# Altium project int_lock.PrjPcb (part 1 of 2)
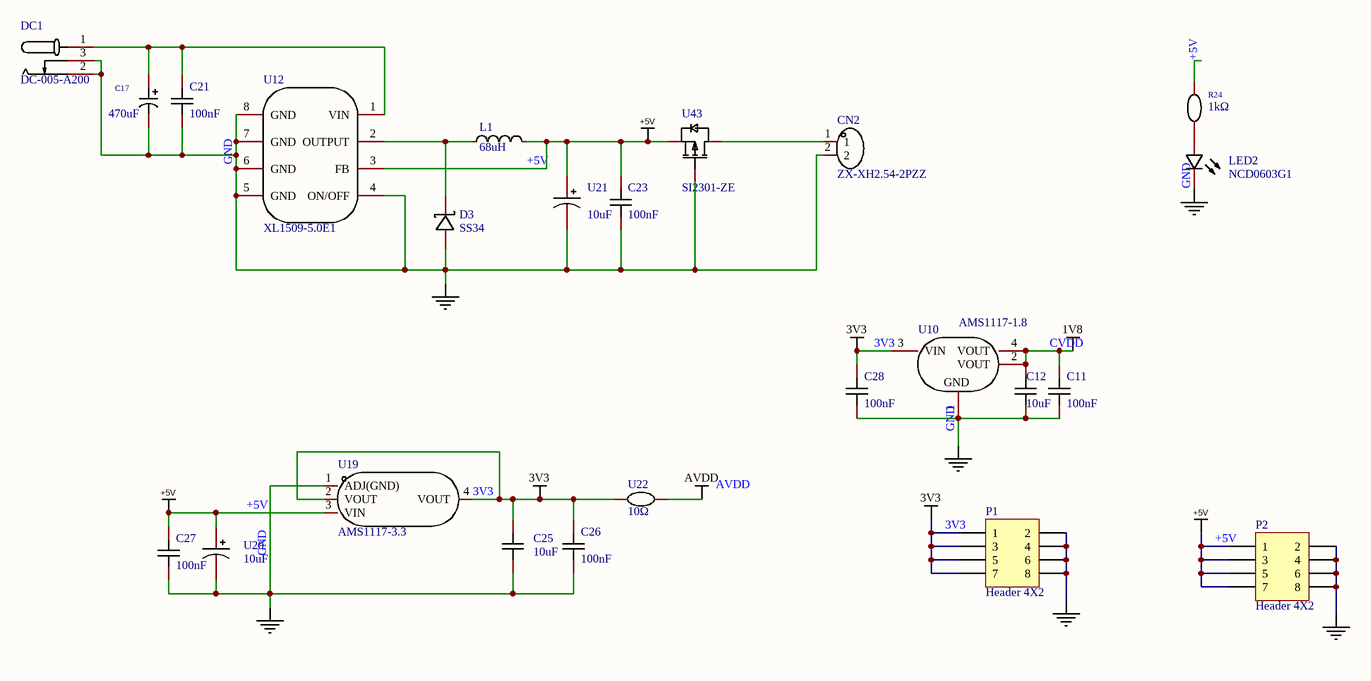
[diagram p0: 4_POW.schdoc.schdoc]
4 sheets, 119 parts. Net scope: global (net labels, ports and power ports of the same name join across sheets).
Board file: PCB1.pcbdoc
Sheets:
  4_POW.schdoc.schdoc
  3_语音模块.schdoc.schdoc
  1_Board.schdoc.schdoc
  2_MCU.schdoc.schdoc

## Sheet 4_POW.schdoc.schdoc
size 309 x 223 mm; Symbol: Sheet-Symbol_A4; Device: Sheet-Symbol_A4; @Page Name: POW.Schematic1; @Create Date: 2023-10-28; @Page Count: 4; @Page No: 3; @Project Name: New Project_2023-10-25_23-03-02; @Schematic Name: Schematic1; @Update Date: 2023-11-27; Company: 嘉立创EDA; Page Size: A4; Version: V1.0; SheetNumber: 1; SheetTotal: 4

### Parts
C11  100nF  [C0603]
C12  10uF  [C0603]
C17  470uF  [CAP-SMD_BD6.3-L6.6-W6.6-LS7.6-RD]
C21  100nF  [C0603]
C23  100nF  [C0603]
C25  10uF  [C0603]
C26  100nF  [C0603]
C27  100nF  [C0603]
C28  100nF  [C0603]
CN2  ZX-XH2.54-2PZZ  [CONN-TH_2P-P2.50_HX25003-2A]
D3  SS34  [SMA_L4.3-W2.6-LS5.0-RD]
DC1  DC-005-A200  [DC-IN-TH_DC-005-A200]
L1  68uH  [IND-SMD_L6.0-W6.0_SWPA6045S]
LED2  NCD0603G1  [LED0603-RD]
P1  Header 4X2  [HDR2X4]
P2  Header 4X2  [HDR2X4]
R24  1kΩ  [R0603]
U10  AMS1117-1.8  [SOT-223-4_L6.5-W3.5-P2.30-LS7.0-BR]
U12  XL1509-5.0E1  [SOIC-8_L5.0-W4.0-P1.27-LS6.0-BL]
U19  AMS1117-3.3  [SOT-223-3_L6.5-W3.4-P2.30-LS7.0-BR]
U20  10uF  [CAP-TH_BD6.3-P2.50-D0.5-FD]
U21  10uF  [CAP-TH_BD6.3-P2.50-D0.5-FD]
U22  10Ω  [R0603]
U43  SI2301-ZE  [SOT-23-3_L2.9-W1.3-P1.90-LS2.4-BR]

### Nets
3V3: C25.2 C26.2 C28.2 P1.1 P1.3 P1.5 P1.7 U10.3(VIN) U19.2(VOUT) U19.4(VOUT) U22.1
+5V: C23.2 C27.2 L1.2 P2.1 P2.3 P2.5 P2.7 R24.2 U12.3(FB) U19.3(VIN) U20.1 U21.1 U43.2(S)
AVDD: U22.2
CVDD: C11.2 C12.2 U10.2(VOUT) U10.4(VOUT)  [also labelled 1V8]
GND: C11.1 C12.1 C17.2 C21.1 C23.1 C25.1 C26.1 C27.1 C28.1 CN2.2 D3.2(A) DC1.2 DC1.3 LED2.1(K) P1.2 P1.4 P1.6 P1.8 P2.2 P2.4 P2.6 P2.8 U10.1(GND) U12.4(ON/OFF) U12.5(GND) U12.6(GND) U12.7(GND) U12.8(GND) U19.1(ADJ(GND)) U20.2 U21.2 U43.1(G)
NetC17_1: C17.1 C21.2 DC1.1 U12.1(VIN)
NetCN2_1: CN2.1 U43.3(D)
NetD3_1: D3.1(K) L1.1 U12.2(OUTPUT)
NetLED2_2: LED2.2(A) R24.1

### Notes on the sheet
- Labels drawn without touching a wire or pin: AVDD
- 1
- 2
- 3
- 4
- 5
- 6
- A
- B
- C
- 原理图
- Schematic1
- 创建日期
- 更新日期
- 2023-10-28
- 2023-11-27
- 审阅
- 绘制
- 图页
- POW.Schematic1
- 物料编码
- New Project_2023-10-25_23-03-02
- D
- 版本
- 尺寸
- 页
- 共
- V1.0
- A4
- 嘉立创EDA

### Library data of the parts
C11 C21 C23 C26-C28 = CGA3E3X8R1H104M080AE: 容值:100nF;精度:±20%;额定电压:50V;材质(温度系数):X8R;; Manufacturer: TDK; Add into BOM: yes; Tolerance: ±20%; Voltage Rated: 50V; Temperature Coefficient: X8R; Name: 100nF; Symbol: CGA3E3X8R1H104M080AE; Device: CGA3E3X8R1H104M080AE; LCSC Part Name: 100nF ±20% 50V; Supplier Part: C3855738; Manufacturer Part: CGA3E3X8R1H104M080AE; Supplier Footprint: 0603; Supplier: LCSC; Convert to PCB: yes; Value: 100nF
C12 C25 = C1608X6S0J106M080AC: 容值:10uF;精度:±20%;额定电压:6.3V;材质(温度系数):X6S;; Manufacturer: TDK; Symbol: C1608X6S0J106M080AC_C314596-1; Add into BOM: yes; Tolerance: ±20%; Voltage Rated: 6.3V; Temperature Coefficient: X6S; Name: 10uF; Device: C1608X6S0J106M080AC; LCSC Part Name: 10uF ±20% 6.3V; Supplier Part: C314596; Manufacturer Part: C1608X6S0J106M080AC; Supplier Footprint: 0603; Datasheet: https://atta.szlcsc.com/upload/public/pdf/source/20221212/519F8C46C56E78A46759B3245CB4AD37.pdf; Supplier: LCSC; Convert to PCB: yes; Value: 10uF
C17 = RVT1C471M0607: 容值:470uF;精度:±20%;额定电压:16V;电容体直径:6.3mm;电容体长度:7.7mm;工作寿命:2000hrs@105℃;工作温度:-55℃~+105℃;; Manufacturer: ROQANG(容强); Add into BOM: yes; Tolerance: ±20%; Rated Voltage: 16V; φD: 6.3mm; L: 7.7mm; Name: 470uF; Symbol: RVT1C471M0607; Device: RVT1C471M0607; LCSC Part Name: 470uF ±20% 16V; Supplier Part: C2977552; Manufacturer Part: RVT1C471M0607; Supplier Footprint: SMD,6.3x7.7mm; JLCPCB Part Class: 扩展库; Supplier: LCSC; Convert to PCB: yes; Value: 470uF; Lifetime @ Temp: 2000hrs@105℃; Operating Temperature: -55℃~+105℃
CN2 = ZX-XH2.54-2PZZ: 参考系列:XH;间距:2.54mm;插针结构:1x2P;排数:1;每排PIN数:2;行距:-;公母:公型插针;安装方式:直插;额定电流:3A;触头材质:黄铜;触头镀层:锡;工作温度范围:-25℃~+85℃;焊接温度(最大值):260℃;; Manufacturer: Megastar(兆星); Add into BOM: yes; Reference Series: XH; Pitch: 2.54mm; Pins Structure: 1x2P; Number of PINs Per Row: 2; Gender: 公型插针; Current Rating (Max): 3A; Welding Temperature (Max): 260℃; Name: ZX-XH2.54-2PZZ; Symbol: ZX-XH2.54-2PZZ; Device: ZX-XH2.54-2PZZ; LCSC Part Name: 系列:XH 间距:2.54mm 1x2P 直插; Supplier Part: C7429632; Manufacturer Part: ZX-XH2.54-2PZZ; Supplier Footprint: 插件,P=2.54mm; JLCPCB Part Class: 扩展库; Datasheet: https://atta.szlcsc.com/upload/public/pdf/source/20230619/19BA6947230AA44A04D3EDD65E618FD0.pdf; Supplier: LCSC; Convert to PCB: yes; Number of Rows: 1; Row Spacing: -; Mounting Style: 直插; Contact Material: 黄铜; Contact Plating: 锡; Operating Temperature Range: -25℃~+85℃
D3 = SS34: Symbol: SS34_C9900023345; Add into BOM: yes; Name: SS34; Device: SS34; LCSC Part Name: SS34; Supplier Part: C9900023345; Manufacturer Part: SS34; Supplier Footprint: SMA,DO-214AC; JLCPCB Part Class: 扩展库; Datasheet: 2022-07-04/534833A/5ff3008f79ea4c6ab22b1f3463cee262/20210714020425519.pdf; Supplier: LCSC; Convert to PCB: yes
DC1 = DC-005-A200: DC-005 外径6.4 内芯2.0 3A电流 DC电源插座; Manufacturer: XUNPU(讯普); Add into BOM: yes; Name: DC-005-A200; Symbol: DC-005-A200; Device: DC-005-A200; LCSC Part Name: DC-005-A200; Supplier Part: C720557; Manufacturer Part: DC-005-A200; Supplier Footprint: 14×9.0×11.0mm; JLCPCB Part Class: 扩展库; Datasheet: https://atta.szlcsc.com/upload/public/pdf/source/20200812/C720557_2286DFCD6C75B71AF905731F627ABF3A.pdf; Supplier: LCSC; Convert to PCB: yes
L1 = SWPA6045S680MT: 类型:-;电感值:68uH;精度:±20%;额定电流:1A;饱和电流(Isat):1.2A;; Manufacturer: Sunlord(顺络); Add into BOM: yes; Tolerance: ±20%; Rated Current: 1A; Saturation Current (Isat): 1.2A; DC Resistance (DCR): 289mΩ; Name: 68uH; Symbol: SWPA6045S680MT; Device: SWPA6045S680MT; LCSC Part Name: 68uH ±20% 1.2A; Supplier Part: C53663; Manufacturer Part: SWPA6045S680MT; Supplier Footprint: SMD; JLCPCB Part Class: 扩展库; Datasheet: https://atta.szlcsc.com/upload/public/pdf/source/20210916/AC798BA7E846B7D0B6818F45CD84DB0B.pdf; Supplier: LCSC; Convert to PCB: yes; Type: -; Value: 68uH; Ratings: -
LED2 = NCD0603G1: 发光颜色:翠绿色;功率:72mW;透镜颜色:无色透明;主波长:515nm~530nm;发光强度:330mcd~900mcd;发光角度:130°;工作温度:-30℃~+85℃;; Manufacturer: 国星光电; Symbol: FC-D1608UGK-520D10; Add into BOM: yes; Emitted Color: 翠绿色; Forward Voltage (VF): 2.6V~3.6V; Forward Current: 10mA; Power Dissipation: 72mW; Lens Color: 无色透明; Viewing Angle: 130°; Name: NCD0603G1; Device: NCD0603G1; LCSC Part Name: 翠绿 0603翠绿  正贴; Supplier Part: C84267; Manufacturer Part: NCD0603G1; Supplier Footprint: 0603; JLCPCB Part Class: 扩展库; Datasheet: https://atta.szlcsc.com/upload/public/pdf/source/20200820/C84267_04BA7703640BAC111D09F5EFB971FBF3.pdf; Supplier: LCSC; Convert to PCB: yes; Dominant Wavelength: 515nm~530nm; Luminous Intensity: 330mcd~900mcd; Operating Temperature: -30℃~+85℃
P1 P2 = Header 4X2: Header, 4-Pin, Dual row; LatestRevisionDate: 17-Jul-2002; LatestRevisionNote: Re-released for DXP Platform.; Publisher: Altium Limited
R24 = SCR0603F1K: 阻值:1kΩ;精度:±1%;; Manufacturer: VO(翔胜); Add into BOM: yes; Tolerance: ±1%; Name: 1kΩ; Symbol: SCR0603F1K; Device: SCR0603F1K; LCSC Part Name: 1kΩ ±1%; Supplier Part: C3016283; Manufacturer Part: SCR0603F1K; Supplier Footprint: 0603; JLCPCB Part Class: 扩展库; Datasheet: https://atta.szlcsc.com/upload/public/pdf/source/20220513/247AF9639BA21CF93567DC289CCC6A22.pdf; Supplier: LCSC; Convert to PCB: yes; Value: 1kΩ
U10 = AMS1117-1.8: 输出类型:固定;输出极性:正;最大输入电压:18V;输出电压:1.8V;输出电流:1A;电源纹波抑制比(PSRR):-;; Manufacturer: PUOLOP(迪浦); Symbol: AMS1117-1.8_C351432; Add into BOM: yes; Output Type: 固定; Output Polarity: 正; Number of Outputs: 1; Maximum Input Voltage: 18V; Output Voltage: 1.8V; Dropout Voltage: 1.4V@(1A); Output Current: 1A; Name: AMS1117-1.8; Device: AMS1117-1.8; LCSC Part Name: 输入18V 输出1.8V 1A; Supplier Part: C351432; Manufacturer Part: AMS1117-1.8; Supplier Footprint: SOT-223-4; JLCPCB Part Class: 扩展库; Supplier: LCSC; Convert to PCB: yes; Power Supply Rejection Ratio (PSRR): -
U12 = XL1509-5.0E1: 功能类型:降压型;输入电压:-;输出电流(最大值):-;; Manufacturer: XLSEMI(芯龙); Add into BOM: yes; Function: 降压型; Name: XL1509-5.0E1; Symbol: XL1509-5.0E1; Device: XL1509-5.0E1; LCSC Part Name: XL1509-5.0E1; Supplier Part: C61063; Manufacturer Part: XL1509-5.0E1; Supplier Footprint: SOP-8; JLCPCB Part Class: 基础库; Datasheet: https://atta.szlcsc.com/upload/public/pdf/source/20151126/1457707596805.pdf; Supplier: LCSC; Convert to PCB: yes; Synchronous Rectification: -; Number of Outputs: -; Topology: -; Input Voltage: -; Output Current (Max): -; Switching Frequency: -
U19 = AMS1117-3.3: 输出类型:固定;输出极性:正;输出通道数:1;最大输入电压:18V;输出电压:3.3V;压差:1.3V@(1A);输出电流:1A;电源纹波抑制比(PSRR):60dB@(120Hz);工作温度:±150℃@(Tj);; Manufacturer: YONGYUTAI(永裕泰); Symbol: AMS1117-3.3_C2891839; Add into BOM: yes; Output Type: 固定; Output Polarity: 正; Number of Outputs: 1; Maximum Input Voltage: 18V; Output Voltage: 3.3V; Name: AMS1117-3.3; Device: AMS1117-3.3; LCSC Part Name: 正 Vin=18V Vout=3.3V 1A 60dB@(120Hz); Supplier Part: C2891839; Manufacturer Part: AMS1117-3.3; Supplier Footprint: SOT-223-3; JLCPCB Part Class: 扩展库; Datasheet: https://atta.szlcsc.com/upload/public/pdf/source/20210901/A75ADDE6A17DEE0002F2A58A8D1F3634.pdf; Supplier: LCSC; Convert to PCB: yes; Dropout Voltage: 1.3V@(1A); Output Current: 1A; Power Supply Rejection Ratio (PSRR): 60dB@(120Hz); Operating Temperature: ±150℃@(Tj)
U20 U21 = ESK106M1HD11RRSNP-R: 容值:10uF;精度:±20%;额定电压:50V;纹波电流:-;等效串联电阻:-;; Manufacturer: MAN YUE(万裕科技); Add into BOM: yes; Tolerance: ±20%; Rated Voltage: 50V; φD: 5mm; L: 11mm; Name: 10uF; Symbol: ESK106M1HD11RRSNP-R; Device: ESK106M1HD11RRSNP-R; LCSC Part Name: 10uF ±20% 50V; Supplier Part: C3015490; Manufacturer Part: ESK106M1HD11RRSNP-R; Supplier Footprint: 插件; JLCPCB Part Class: 扩展库; Datasheet: https://atta.szlcsc.com/upload/public/pdf/source/20190724/C406799_CDF11B2185D3B9C175922EABD678815E.pdf; Supplier: LCSC; Convert to PCB: yes; Value: 10uF; Lead Spacing: -; Ripple Current: -; Equivalent Series Resistance(ESR): -; Lifetime @ Temp: -; Operating Temperature: -
U22 = PCAN0603E10R0BST5: 电阻类型:薄膜电阻;阻值:10Ω;精度:±0.1%;功率:500mW;; Manufacturer: VISHAY(威世); Add into BOM: yes; Tolerance: ±0.1%; Power(Watts): 500mW; Temperature Coefficient: ±25ppm/℃; Overload Voltage (Max): 75V; Name: 10Ω; Symbol: PCAN0603E10R0BST5; Device: PCAN0603E10R0BST5; LCSC Part Name: 10Ω ±0.1% 500mW; Supplier Part: C2091258; Manufacturer Part: PCAN0603E10R0BST5; Supplier Footprint: 0603; JLCPCB Part Class: 扩展库; Datasheet: https://atta.szlcsc.com/upload/public/pdf/source/20210606/BB102AFC1F3ADA31AF003395293DA88D.pdf; Supplier: LCSC; Convert to PCB: yes; Type: 薄膜电阻; Value: 10Ω; Operating Temperature Range: -55℃~+155℃
U43 = SI2301-ZE: 漏源电压(Vdss):20V;连续漏极电流(Id):2.3A;功率(Pd):700mW;类型:P沟道;导通电阻(RDS(on)@Vgs,Id):126mΩ@4.5V;; Manufacturer: HXY MOSFET(华轩阳电子); Add into BOM: yes; Gate Threshold Voltage (Vgs(th)@Id): 1V@250uA; Drain Source Voltage (Vdss): 20V; Continuous Drain Current (Id): 2.3A; Power Dissipation (Pd): 700mW; Input Capacitance (Ciss@Vds): 285pF; Name: SI2301-ZE; Symbol: SI2301-ZE; Device: SI2301-ZE; LCSC Part Name: P沟道 耐压:20V 电流:2.3A; Supplier Part: C5261052; Manufacturer Part: SI2301-ZE; Supplier Footprint: SOT-23; JLCPCB Part Class: 扩展库; Datasheet: https://atta.szlcsc.com/upload/public/pdf/source/20230515/2FF2907841563ED329594D3237822724.pdf; Supplier: LCSC; Convert to PCB: yes; Type: P沟道; Drain Source On Resistance (RDS(on)@Vgs,Id): 126mΩ@4.5V

## Sheet 3_语音模块.schdoc.schdoc
size 309 x 223 mm; Symbol: Sheet-Symbol_A4; Device: Sheet-Symbol_A4; @Page Name: 语音模块; @Create Date: 2023-10-28; @Page Count: 4; @Page No: 2; @Project Name: New Project_2023-10-25_23-03-02; @Schematic Name: Schematic1; @Update Date: 2023-11-07; Company: 嘉立创EDA; Page Size: A4; Version: V1.0; SheetNumber: 2; SheetTotal: 4
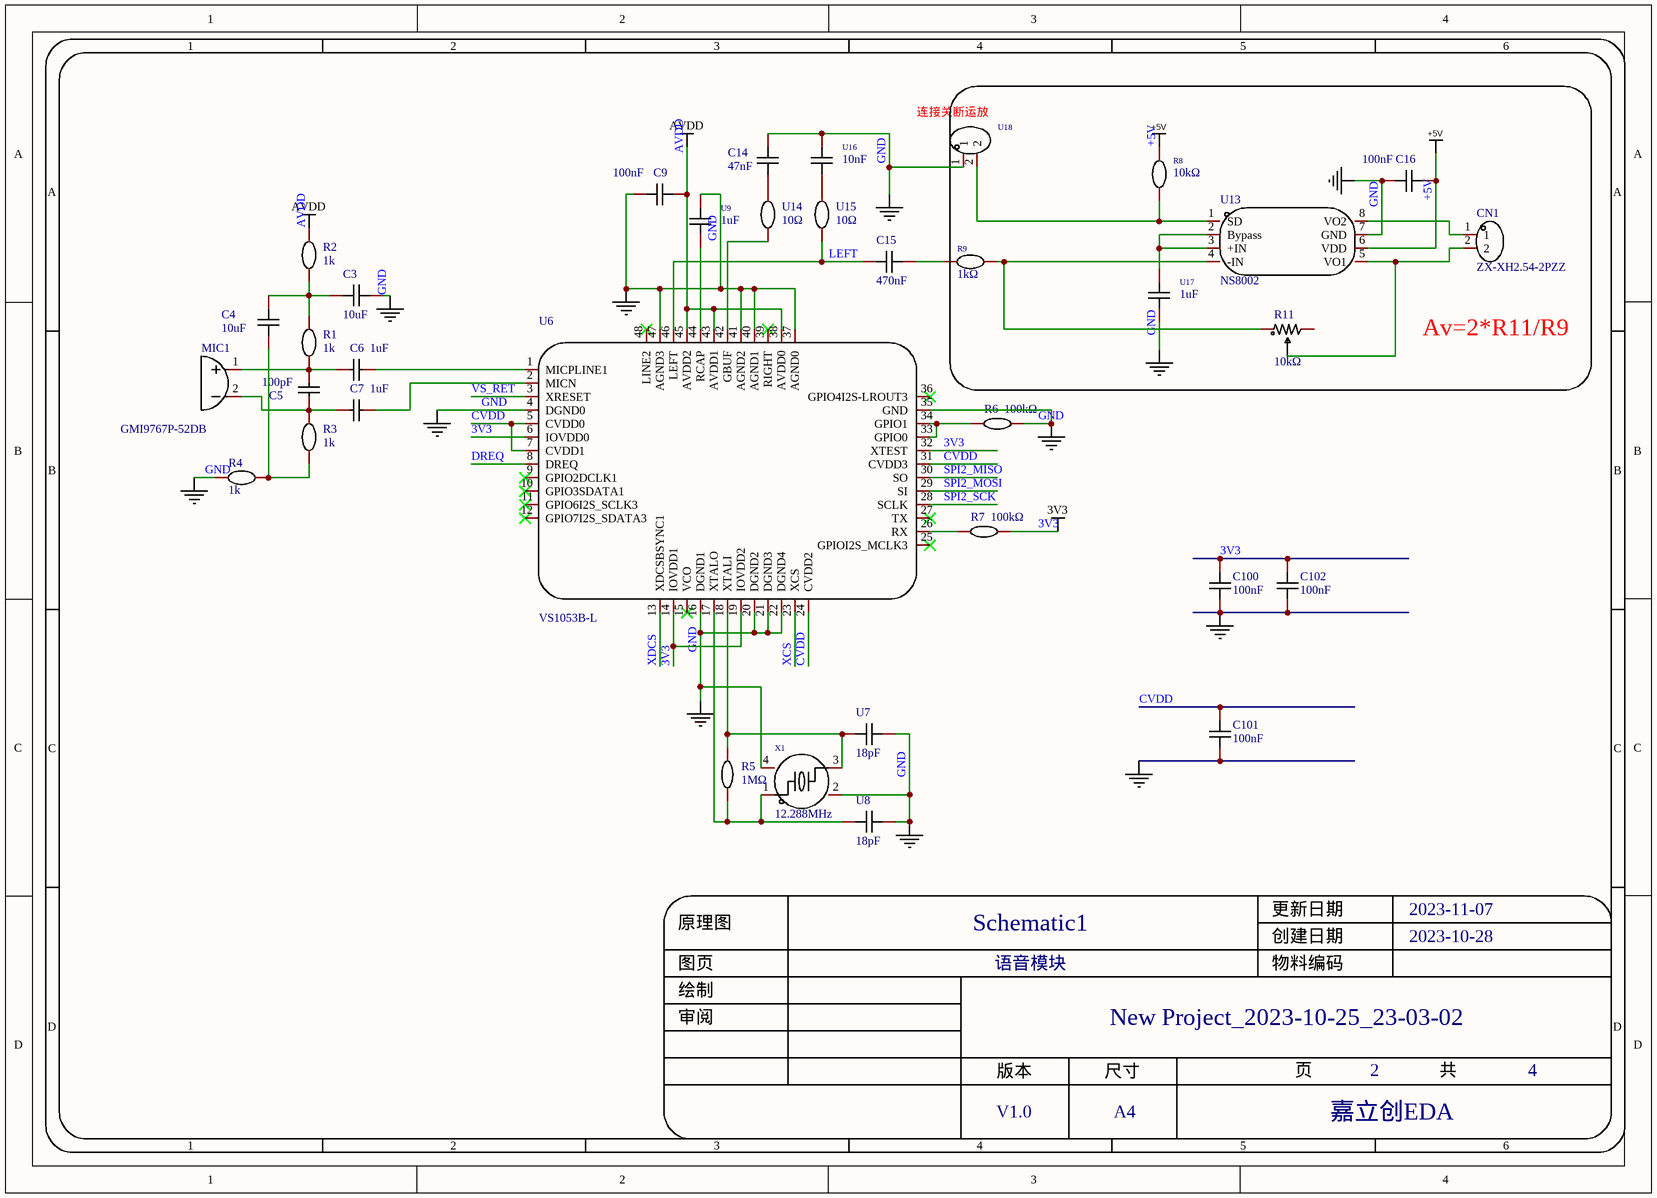
[diagram p1: 3_语音模块.schdoc.schdoc]

### Parts
C3  10uF  [C0603]
C4  10uF  [C0603]
C5  100pF  [C0603]
C6  1uF  [C0603]
C7  1uF  [C0603]
C9  100nF  [C0603]
C14  47nF  [C0603]
C15  470nF  [C0805]
C16  100nF  [C0603]
C100  100nF  [C0603]
C101  100nF  [C0603]
C102  100nF  [C0603]
CN1  ZX-XH2.54-2PZZ  [CONN-TH_2P-P2.50_HX25003-2A]
MIC1  GMI9767P-52DB  [MIC-TH_BD9.7-P2.54-D0.8-L-FD]
R1  1k  [R0603]
R2  1k  [R0603]
R3  1k  [R0603]
R4  1k  [R0603]
R5  1MΩ  [R0603]
R6  100kΩ  [R0603]
R7  100kΩ  [R0603]
R8  10kΩ  [R0603]
R9  1kΩ  [R0603]
R11  10kΩ  [RES-ADJ-TH_3362P]
U6  VS1053B-L  [LQFP-48_L7.0-W7.0-P0.50-LS9.0-BL]
U7  18pF  [C0603]
U8  18pF  [C0603]
U9  1uF  [C0603]
U13  NS8002  [SOP-8_L4.9-W3.9-P1.27-LS6.0-BL]
U14  10Ω  [R0603]
U15  10Ω  [R0603]
U16  10nF  [C0603]
U17  1uF  [C0603]
U18  PZ200-1-02-Z-C  [HDR-TH_2P-P2.00-V-M-3]  (value not drawn)
X1  12.288MHz  [CRYSTAL-SMD_4P-L3.2-W2.5-BL]

### Blocks framed on the sheet
Av=2*R11/R9: C16 CN1 R8 R9 R11 U13 U17 U18

### Nets
3V3: C100.1 C102.1 R7.2 U6.6(IOVDD0) U6.14(IOVDD1) U6.19(IOVDD2) U6.32(XTEST)
+5V: C16.1 R8.2 U13.6(VDD)
AVDD: C9.1 R2.2 U6.38(AVDD0) U6.43(AVDD1) U6.45(AVDD2)
CVDD: C101.1 U6.5(CVDD0) U6.7(CVDD1) U6.24(CVDD2) U6.31(CVDD3)
GND: C3.2 C9.2 C14.2 C16.2 C100.2 C101.2 C102.2 R4.2 R6.2 U6.4(DGND0) U6.16(DGND1) U6.20(DGND2) U6.21(DGND3) U6.22(DGND4) U6.35(GND) U6.37(AGND0) U6.40(AGND1) U6.41(AGND2) U6.47(AGND3) U7.2 U8.2 U9.2 U13.7(GND) U16.2 U17.1 U18.1 X1.2(GND) X1.4(GND)
DREQ: U6.8(DREQ)
LEFT: C15.1 U6.46(LEFT) U15.1
SPI2_MISO: U6.30(SO)
SPI2_MOSI: U6.29(SI)
SPI2_SCK: U6.28(SCLK)
VS_RET: U6.3(XRESET)
XCS: U6.23(XCS)
XDCS: U6.13(XDCSBSYNC1)
NetC3_1: C3.1 C4.2 R1.2 R2.1
NetC4_1: C4.1 R3.1 R4.1
NetC5_1: C5.1 C7.1 MIC1.2 R3.2
NetC5_2: C5.2 C6.1 MIC1.1 R1.1
NetC6_2: C6.2 U6.1(MICPLINE1)
NetC7_2: C7.2 U6.2(MICN)
NetC14_1: C14.1 U14.2
NetC15_2: C15.2 R9.1
NetCN1_1: CN1.1 U13.8(VO2)
NetCN1_2: CN1.2 R11.2 U13.5(VO1)
NetR5_1: R5.1 U6.17(XTALO) U8.1 X1.1
NetR5_2: R5.2 U6.18(XTALI) U7.1 X1.3
NetR6_1: R6.1 U6.33(GPIO0) U6.34(GPIO1)
NetR7_1: R7.1 U6.26(RX)
NetR8_1: R8.1 U13.1(SD) U18.2
NetR9_2: R9.2 R11.1 U13.4(-IN)
NetU6_42: U6.42(GBUF) U14.1
NetU6_44: U6.44(RCAP) U9.1
NetU13_2: U13.2(Bypass) U13.3(+IN) U17.2
NetU15_2: U15.2 U16.1

Not connected (* = marked no-connect by the designer): R11 3; U6 9(GPIO2DCLK1)* 10(GPIO3SDATA1)* 11(GPIO6I2S_SCLK3)* 12(GPIO7I2S_SDATA3)* 15(VCO)* 25(GPIOI2S_MCLK3)* 27(TX)* 36(GPIO4I2S-LROUT3)* 39(RIGHT)* 48(LINE2)*

### Notes on the sheet
- (near U18) 连接关断运放
- 1
- 2
- 3
- 4
- 5
- 6
- A
- B
- C
- 原理图
- Schematic1
- 创建日期
- 更新日期
- 2023-10-28
- 2023-11-07
- 审阅
- 绘制
- 图页
- 语音模块
- 物料编码
- New Project_2023-10-25_23-03-02
- D
- 版本
- 尺寸
- 页
- 共
- V1.0
- A4
- 嘉立创EDA

### Library data of the parts
C3 C4 = CL10A106MA8NRNC: 容值:10uF;精度:±20%;额定电压:25V;材质(温度系数):X5R;; Manufacturer: SAMSUNG(三星); Add into BOM: yes; Tolerance: ±20%; Voltage Rated: 25V; Temperature Coefficient: X5R; Name: 10uF; Symbol: CL10A106MA8NRNC; Device: CL10A106MA8NRNC; LCSC Part Name: 10uF ±20% 25V; Supplier Part: C96446; Manufacturer Part: CL10A106MA8NRNC; Supplier Footprint: 0603; JLCPCB Part Class: 基础库; Datasheet: https://atta.szlcsc.com/upload/public/pdf/source/20170325/1490427913016.pdf; Supplier: LCSC; Convert to PCB: yes; Value: 10uF
C5 = CL10C101JB8NNNC: 容值:100pF;精度:±5%;额定电压:50V;材质(温度系数):C0G;; Manufacturer: SAMSUNG(三星); Add into BOM: yes; Tolerance: ±5%; Voltage Rated: 50V; Temperature Coefficient: C0G; Name: 100pF; Symbol: CL10C101JB8NNNC; Device: CL10C101JB8NNNC; LCSC Part Name: 100pF ±5% 50V; Supplier Part: C14858; Manufacturer Part: CL10C101JB8NNNC; Supplier Footprint: 0603; JLCPCB Part Class: 基础库; Datasheet: https://atta.szlcsc.com/upload/public/pdf/source/20160103/1457707672333.pdf; Supplier: LCSC; Convert to PCB: yes; Value: 100pF
C6 C7 = CL10A105KB8NNNC: 容值:1uF;精度:±10%;额定电压:50V;材质(温度系数):X5R;; Manufacturer: SAMSUNG(三星); Add into BOM: yes; Tolerance: ±10%; Voltage Rated: 50V; Temperature Coefficient: X5R; Name: 1uF; Symbol: CL10A105KB8NNNC; Device: CL10A105KB8NNNC; LCSC Part Name: 1uF ±10% 50V; Supplier Part: C15849; Manufacturer Part: CL10A105KB8NNNC; Supplier Footprint: 0603; JLCPCB Part Class: 基础库; Datasheet: https://atta.szlcsc.com/upload/public/pdf/source/20160103/1457707679084.pdf; Supplier: LCSC; Convert to PCB: yes; Value: 1uF
C9 C16 C100-C102 = CGA3E3X8R1H104M080AE: as C11 on sheet 4_POW.schdoc; Name: 100nF; Symbol: CGA3E3X8R1H104M080AE; Device: CGA3E3X8R1H104M080AE; LCSC Part Name: 100nF ±20% 50V; Supplier Part: C3855738; Manufacturer Part: CGA3E3X8R1H104M080AE; Supplier Footprint: 0603; Supplier: LCSC; Convert to PCB: yes; Value: 100nF
C14 = C1608X8R1H473K080AA: 容值:47nF;额定电压:50V;材质(温度系数):X8R;; Manufacturer: TDK; Add into BOM: yes; Voltage Rated: 50V; Temperature Coefficient: X8R; Name: 47nF; Symbol: C1608X8R1H473K080AA; Device: C1608X8R1H473K080AA; LCSC Part Name: 47nF 50V; Supplier Part: C3890694; Manufacturer Part: C1608X8R1H473K080AA; Supplier Footprint: 0603; Supplier: LCSC; Convert to PCB: yes; Value: 47nF
C15 = CC0805KKX7R0BB474: 容值:470nF;精度:±10%;额定电压:100V;材质(温度系数):X7R;; Manufacturer: YAGEO(国巨); Symbol: GRM21BR60E107ME15L; Add into BOM: yes; Tolerance: ±10%; Voltage Rated: 100V; Temperature Coefficient: X7R; Name: 470nF; Device: CC0805KKX7R0BB474; LCSC Part Name: 470nF ±10% 100V; Supplier Part: C596323; Manufacturer Part: CC0805KKX7R0BB474; Supplier Footprint: 0805; JLCPCB Part Class: Extended Part; Datasheet: https://atta.szlcsc.com/upload/public/pdf/source/20200609/C596323_82E7DD20666BC3809E26A1262184D295.pdf; Supplier: LCSC; Convert to PCB: yes; Value: 470nF
CN1 = ZX-XH2.54-2PZZ: as CN2 on sheet 4_POW.schdoc; Name: ZX-XH2.54-2PZZ; Symbol: ZX-XH2.54-2PZZ; Device: ZX-XH2.54-2PZZ; LCSC Part Name: 系列:XH 间距:2.54mm 1x2P 直插; Supplier Part: C7429632; Manufacturer Part: ZX-XH2.54-2PZZ; Supplier Footprint: 插件,P=2.54mm; JLCPCB Part Class: 扩展库; Datasheet: https://atta.szlcsc.com/upload/public/pdf/source/20230619/19BA6947230AA44A04D3EDD65E618FD0.pdf; Supplier: LCSC; Convert to PCB: yes; Number of Rows: 1; Row Spacing: -; Mounting Style: 直插; Contact Material: 黄铜; Contact Plating: 锡; Operating Temperature Range: -25℃~+85℃
MIC1 = GMI9767P-52DB: Manufacturer: INGHAi(赢海); Add into BOM: yes; Name: GMI9767P-52DB; Symbol: GMI9767P-52DB; Device: GMI9767P-52DB; LCSC Part Name: 全指向φ9.7*6.7mm 1.5V-10V 灵敏度-52db 低阻抗 针脚; Supplier Part: C234023; Manufacturer Part: GMI9767P-52DB; Supplier Footprint: 插件; JLCPCB Part Class: 扩展库; Datasheet: https://atta.szlcsc.com/upload/public/pdf/source/20200113/C234023_1CE1EA91B70FB2D654251C10F12F6FAC.pdf; Supplier: LCSC; Convert to PCB: yes
R1-R4 = 1k: Add into BOM: yes; Name: 1k; Symbol: 1K; Device: 1k; LCSC Part Name: 1k; Supplier Part: C9900012840; Manufacturer Part: 1k; Supplier Footprint: R0603; JLCPCB Part Class: 扩展库; Supplier: LCSC; Convert to PCB: yes
R5 = 0603WAF1004T5E: 电阻类型:厚膜电阻;阻值:1MΩ;精度:±1%;功率:100mW;温度系数:±100ppm/℃;; Manufacturer: UNI-ROYAL(厚声); Add into BOM: yes; Tolerance: ±1%; Power(Watts): 100mW; Overload Voltage (Max): 75V; Name: 1MΩ; Symbol: 0603WAF1004T5E; Device: 0603WAF1004T5E; LCSC Part Name: 厚膜电阻 1MΩ ±1% 100mW; Supplier Part: C22935; Manufacturer Part: 0603WAF1004T5E; Supplier Footprint: 0603; JLCPCB Part Class: 基础库; Datasheet: https://atta.szlcsc.com/upload/public/pdf/source/20200306/C422600_1E6D84923E4A46A82E41ADD87F860B5C.pdf; Supplier: LCSC; Convert to PCB: yes; Type: 厚膜电阻; Value: 1MΩ; Temperature Coefficient: ±100ppm/℃; Operating Temperature Range: -55℃~+155℃
R6 R7 = ERJ3EKF1003V: 电阻类型:厚膜电阻;阻值:100kΩ;精度:±1%;功率:100mW;温度系数:±100ppm/℃;; Manufacturer: PANASONIC(松下); Add into BOM: yes; Tolerance: ±1%; Power(Watts): 100mW; Name: 100kΩ; Symbol: ERJ3EKF1003V; Device: ERJ3EKF1003V; LCSC Part Name: 厚膜电阻 100kΩ ±1% 100mW; Supplier Part: C189597; Manufacturer Part: ERJ3EKF1003V; Supplier Footprint: 0603; JLCPCB Part Class: 扩展库; Datasheet: https://atta.szlcsc.com/upload/public/pdf/source/20180524/C193239_FFEA89BB7F9859C8C42240F47AD03C60.pdf; Supplier: LCSC; Convert to PCB: yes; Type: 厚膜电阻; Value: 100kΩ; Temperature Coefficient: ±100ppm/℃; Overload Voltage (Max): -; Operating Temperature Range: -55℃~+155℃
R8 = SCR0603J10K: 阻值:10kΩ;精度:±5%;; Manufacturer: VO(翔胜); Add into BOM: yes; Tolerance: ±5%; Name: 10kΩ; Symbol: SCR0603J10K; Device: SCR0603J10K; LCSC Part Name: 10kΩ ±5%; Supplier Part: C3017715; Manufacturer Part: SCR0603J10K; Supplier Footprint: 0603; JLCPCB Part Class: 扩展库; Datasheet: https://atta.szlcsc.com/upload/public/pdf/source/20220513/247AF9639BA21CF93567DC289CCC6A22.pdf; Supplier: LCSC; Convert to PCB: yes; Value: 10kΩ
R9 = SCR0603F1K: as R24 on sheet 4_POW.schdoc; Name: 1kΩ; Symbol: SCR0603F1K; Device: SCR0603F1K; LCSC Part Name: 1kΩ ±1%; Supplier Part: C3016283; Manufacturer Part: SCR0603F1K; Supplier Footprint: 0603; JLCPCB Part Class: 扩展库; Datasheet: https://atta.szlcsc.com/upload/public/pdf/source/20220513/247AF9639BA21CF93567DC289CCC6A22.pdf; Supplier: LCSC; Convert to PCB: yes; Value: 1kΩ
R11 = 3362P-1-103: 阻值:10kΩ;精度:±10%;; Manufacturer: BOCHEN(博晨); Symbol: 3362P-1-103_C118956; Add into BOM: yes; Tolerance: ±10%; Name: 10kΩ; Device: 3362P-1-103; LCSC Part Name: 10kΩ ±10%; Supplier Part: C118956; Manufacturer Part: 3362P-1-103; Supplier Footprint: 插件; JLCPCB Part Class: 扩展库; Datasheet: https://atta.szlcsc.com/upload/public/pdf/source/20171114/C118956_15106326650691117445.pdf; Supplier: LCSC; Convert to PCB: yes; Value: 10kΩ
U6 = VS1053B-L: MP3芯片; Manufacturer: VLSI; Add into BOM: yes; Name: VS1053B-L; Symbol: VS1053B; Device: VS1053B-L; LCSC Part Name: VS1053B-L; Supplier Part: C9922; Manufacturer Part: VS1053B-L; Supplier Footprint: LQFP-48(7x7); JLCPCB Part Class: 扩展库; Datasheet: https://atta.szlcsc.com/upload/public/pdf/source/20121114/1457706558124.pdf; Supplier: LCSC; Convert to PCB: yes
U7 U8 = C1608CH2A180J080AA: 容值:18pF;精度:±5%;额定电压:100V;材质(温度系数):CH;; Manufacturer: TDK; Add into BOM: yes; Tolerance: ±5%; Voltage Rated: 100V; Temperature Coefficient: CH; Name: 18pF; Symbol: C1608CH2A180J080AA; Device: C1608CH2A180J080AA; LCSC Part Name: 18pF ±5% 100V; Supplier Part: C3847790; Manufacturer Part: C1608CH2A180J080AA; Supplier Footprint: -; JLCPCB Part Class: 扩展库; Supplier: LCSC; Convert to PCB: yes; Value: 18pF
U9 U17 = CGA3E3X5R1V105M080AB: 容值:1uF;精度:±20%;额定电压:35V;材质(温度系数):X5R;; Manufacturer: TDK; Add into BOM: yes; Tolerance: ±20%; Voltage Rated: 35V; Temperature Coefficient: X5R; Name: 1uF; Symbol: CGA3E3X5R1V105M080AB; Device: CGA3E3X5R1V105M080AB; LCSC Part Name: 1uF ±20% 35V; Supplier Part: C3910162; Manufacturer Part: CGA3E3X5R1V105M080AB; Supplier Footprint: 0603; Supplier: LCSC; Convert to PCB: yes; Value: 1uF
U13 = NS8002: 音频功率放大器的类型:Class AB;输出类型:-;输出功率:1.8W x 1 @ 4Ω;工作电压:3V ~ 5.25V;; Manufacturer: Nsiway(纳芯威); Add into BOM: yes; Name: NS8002; Symbol: NS8002; Device: NS8002; LCSC Part Name: NS8002; Supplier Part: C189960; Manufacturer Part: NS8002; Supplier Footprint: SOP-8-EP-150mil; JLCPCB Part Class: 扩展库; Datasheet: https://atta.szlcsc.com/upload/public/pdf/source/20190704/C189960_42E000A0092060C3B2B5B31BC13BD104.pdf; Supplier: LCSC; Convert to PCB: yes; Type: Class AB; Output Type: -; Max Output Power x Channels @ Load: 1.8W x 1 @ 4Ω; Voltage - Supply: 3V ~ 5.25V; Features: 关机
U14 U15 = PCAN0603E10R0BST5: as U22 on sheet 4_POW.schdoc; Name: 10Ω; Symbol: PCAN0603E10R0BST5; Device: PCAN0603E10R0BST5; LCSC Part Name: 10Ω ±0.1% 500mW; Supplier Part: C2091258; Manufacturer Part: PCAN0603E10R0BST5; Supplier Footprint: 0603; JLCPCB Part Class: 扩展库; Datasheet: https://atta.szlcsc.com/upload/public/pdf/source/20210606/BB102AFC1F3ADA31AF003395293DA88D.pdf; Supplier: LCSC; Convert to PCB: yes; Type: 薄膜电阻; Value: 10Ω; Operating Temperature Range: -55℃~+155℃
U16 = C1608X8R2A103K080AA: 容值:10nF;精度:±10%;额定电压:100V;材质(温度系数):X8R;; Manufacturer: TDK; Add into BOM: yes; Tolerance: ±10%; Voltage Rated: 100V; Temperature Coefficient: X8R; Name: 10nF; Symbol: C1608X8R2A103K080AA; Device: C1608X8R2A103K080AA; LCSC Part Name: 10nF ±10% 100V; Supplier Part: C3865495; Manufacturer Part: C1608X8R2A103K080AA; Supplier Footprint: 0603; Supplier: LCSC; Convert to PCB: yes; Value: 10nF
U18 = PZ200-1-02-Z-C: 间距：2.0mm 总PIN位数：2 排数1行距：2.0mm 安类型：直插 圆针：圆针 额定电流：3A 配合针长度：3.7mm 塑高：3mm 端接针长度：3.7mm 触头材质：黄铜 触头镀层：金 工作温度范围：-40℃~+105℃ 焊接温度(最大值)：260℃ 颜色：黑; Manufacturer: HCTL(华灿天禄); Add into BOM: yes; Name: PZ200-1-02-Z-C; Symbol: PZ200-1-02-Z-C; Device: PZ200-1-02-Z-C; LCSC Part Name: PZ200-1-02-Z-C; Supplier Part: C5159793; Manufacturer Part: PZ200-1-02-Z-C; Supplier Footprint: 插件,P=2mm; JLCPCB Part Class: 扩展库; Datasheet: https://atta.szlcsc.com/upload/public/pdf/source/20230609/CA4823EE069156B840028BF818EA617F.pdf; Supplier: LCSC; Convert to PCB: yes
X1 = SX3B12.288F2010F30: 频率:12.288MHz;频率公差:±10ppm;负载电容:20pF;; Manufacturer: SCTF(星通时频); Add into BOM: yes; Crystal Type: 贴片无源晶振; Frequency Tolerance: ±10ppm; Frequency Stability: ±30ppm; Load Capacitance: 20pF; Equivalent Series Resistance (ESR): 100Ω; Name: 12.288MHz; Symbol: SX3B12.288F2010F30; Device: SX3B12.288F2010F30; LCSC Part Name: 12.288MHz ±10ppm 20pF; Supplier Part: C2901655; Manufacturer Part: SX3B12.288F2010F30; Supplier Footprint: SMD3225-4P; JLCPCB Part Class: 扩展库; Datasheet: https://atta.szlcsc.com/upload/public/pdf/source/20211009/3804C1E26C475A85A55BFB80BFD4FE9A.pdf; Supplier: LCSC; Convert to PCB: yes; Value: 12.288MHz; Operating Temperature: -40℃~+85℃

## Sheet 1_Board.schdoc.schdoc
size 309 x 223 mm; Symbol: Sheet-Symbol_A4; Device: Sheet-Symbol_A4; @Page Name: Board; @Create Date: 2023-10-25; @Page Count: 4; @Page No: 1; @Project Name: New Project_2023-10-25_23-03-02; @Schematic Name: Schematic1; @Update Date: 2023-11-27; Company: 嘉立创EDA; Page Size: A4; Version: V1.0; SheetNumber: 3; SheetTotal: 4
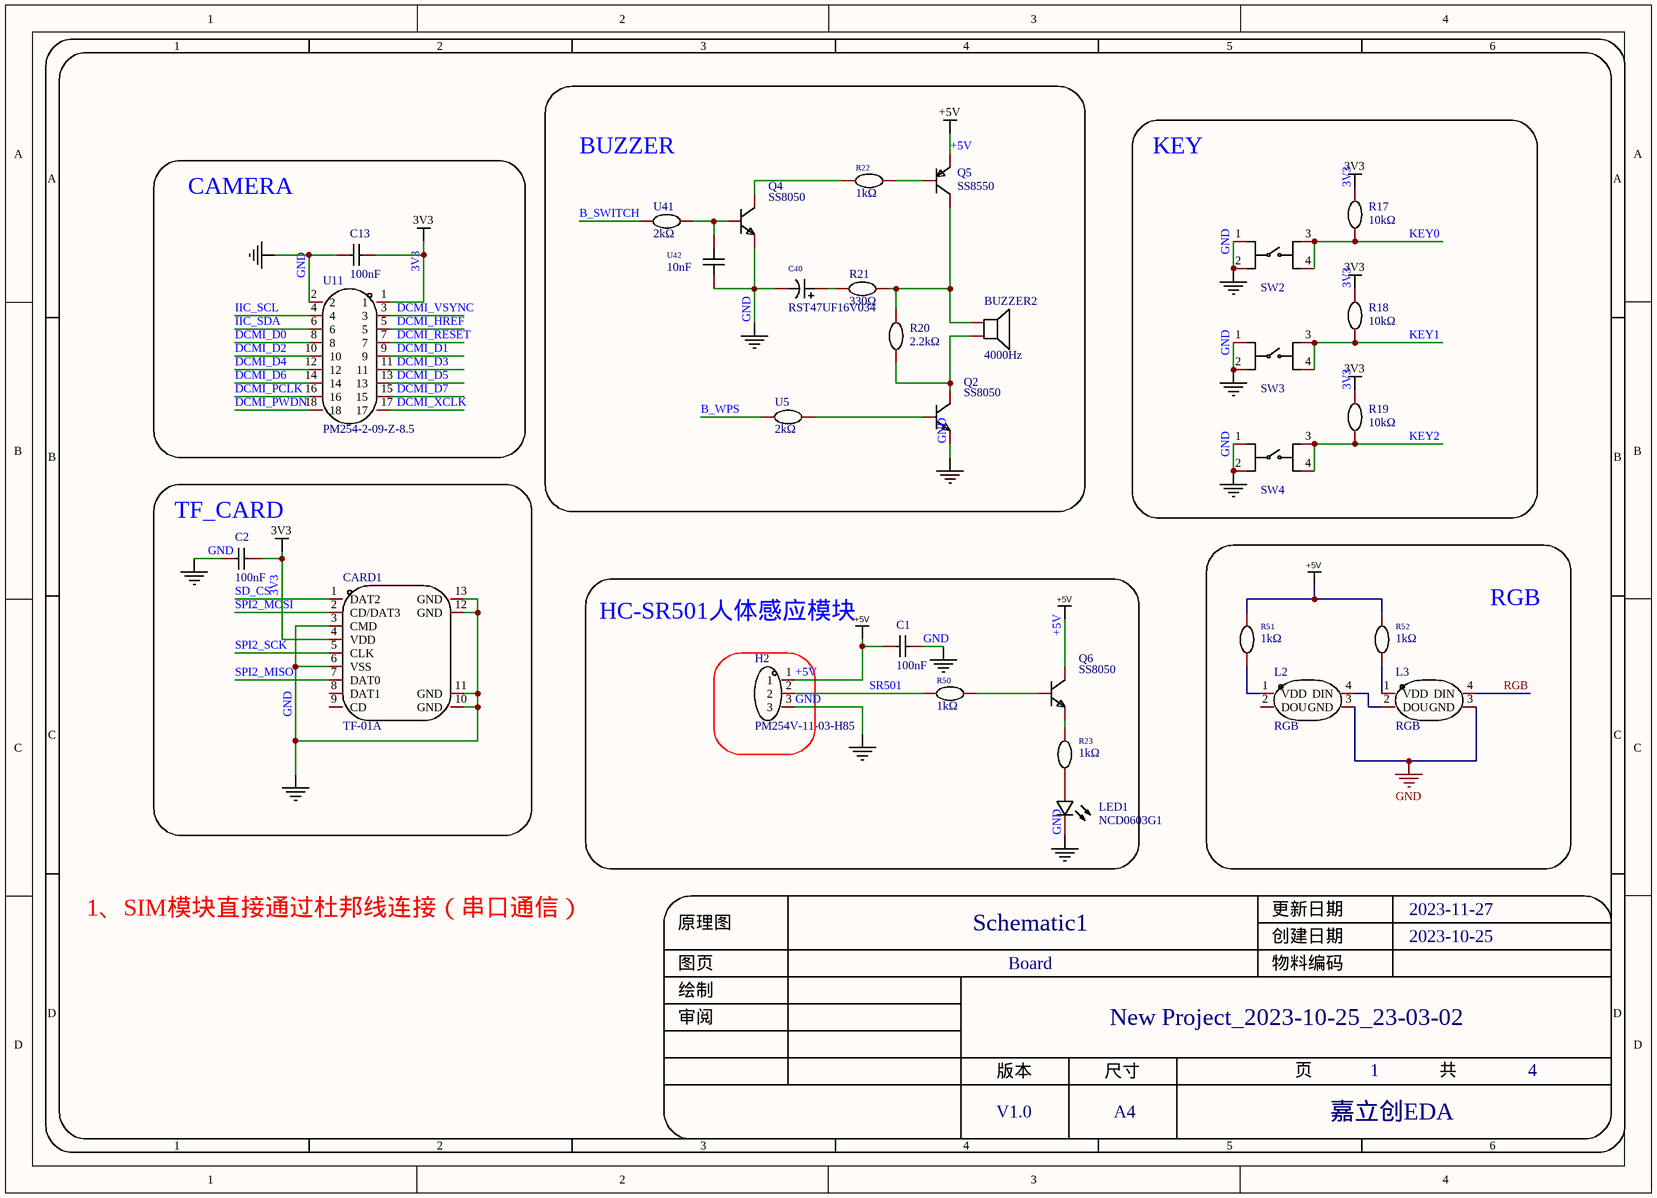
[diagram p2: 1_Board.schdoc.schdoc]

### Parts
BUZZER2  4000Hz  [BUZ-TH_BD14.0-P7.60-D0.7-FD]
C1  100nF  [C0603]
C2  100nF  [C0603]
C13  100nF  [C0603]
C40  RST47UF16V034  [CAP-SMD_BD5.0-L5.3-W5.3-LS6.0-FD]
CARD1  TF-01A  [TF-SMD_TF-02]
H2  PM254V-11-03-H85  [HDR-TH_3P-P2.54-V-F]
L2  RGB  [RGB]
L3  RGB  [RGB]
LED1  NCD0603G1  [LED0603-RD]
Q2  SS8050  [SOT-23-3_L2.9-W1.3-P1.90-LS2.4-BR]
Q4  SS8050  [SOT-23-3_L2.9-W1.3-P1.90-LS2.4-BR]
Q5  SS8550  [SOT-23-3_L2.9-W1.3-P1.90-LS2.4-BR]
Q6  SS8050  [SOT-23-3_L2.9-W1.3-P1.90-LS2.4-BR]
R17  10kΩ  [R0603]
R18  10kΩ  [R0603]
R19  10kΩ  [R0603]
R20  2.2kΩ  [R0603]
R21  330Ω  [R0603]
R22  1kΩ  [R0603]
R23  1kΩ  [R0603]
R50  1kΩ  [R0603]
R51  1kΩ  [R0603]
R52  1kΩ  [R0603]
SW2  K2-6639SP-C4SC-04  [KEY-SMD_4P-L6.0-W6.0-P3.90-LS10.0]  (value not drawn)
SW3  K2-6639SP-C4SC-04  [KEY-SMD_4P-L6.0-W6.0-P3.90-LS10.0]  (value not drawn)
SW4  K2-6639SP-C4SC-04  [KEY-SMD_4P-L6.0-W6.0-P3.90-LS10.0]  (value not drawn)
U5  2kΩ  [R0603]
U11  PM254-2-09-Z-8.5  [HDR-TH_18P-P2.54-V-F-R2-C9-S2.54]
U41  2kΩ  [R0603]
U42  10nF  [C0603]

### Blocks framed on the sheet
BUZZER: BUZZER2 C40 Q2 Q4 Q5 R20-R22 U5 U41 U42
KEY: R17-R19 SW2-SW4
CAMERA: C13 U11
TF_CARD: C2 CARD1
RGB: L2 L3 R51 R52
HC-SR501人体感应模块: C1 H2 LED1 Q6 R23 R50

### Nets
3V3: C2.2 C13.2 CARD1.4(VDD) R17.2 R18.2 R19.2 U11.1
+5V: C1.2 H2.1 Q5.2(E) Q6.3(C) R51.2 R52.2
GND: C1.1 C2.1 C13.1 C40.2 CARD1.3(CMD) CARD1.6(VSS) CARD1.10(GND) CARD1.11(GND) CARD1.12(GND) CARD1.13(GND) H2.3 L2.3(GND) L3.3(GND) LED1.1(K) Q2.2(E) Q4.2(E) SW2.1 SW2.2 SW3.1 SW3.2 SW4.1 SW4.2 U11.2 U42.1
B_SWITCH: U41.2
B_WPS: U5.2
DCMI_D0: U11.8
DCMI_D1: U11.9
DCMI_D2: U11.10
DCMI_D3: U11.11
DCMI_D4: U11.12
DCMI_D5: U11.13
DCMI_D6: U11.14
DCMI_D7: U11.15
DCMI_HREF: U11.5
DCMI_PCLK: U11.16
DCMI_PWDN: U11.18
DCMI_RESET: U11.7
DCMI_VSYNC: U11.3
DCMI_XCLK: U11.17
IIC_SCL: U11.4
IIC_SDA: U11.6
KEY0: R17.1 SW2.3 SW2.4
KEY1: R18.1 SW3.3 SW3.4
KEY2: R19.1 SW4.3 SW4.4
RGB: L3.4(DIN)  [project net PE14]
SD_CS: CARD1.1(DAT2)
SPI2_MISO: CARD1.7(DAT0)
SPI2_MOSI: CARD1.2(CD/DAT3)
SPI2_SCK: CARD1.5(CLK)
SR501: H2.2 R50.2
NetBUZZER2_1: BUZZER2.1 Q5.3(C) R20.2 R21.2
NetBUZZER2_2: BUZZER2.2 Q2.3(C) R20.1
NetC40_1: C40.1 R21.1
NetL2_1: L2.1(VDD) R51.1
NetL2_4: L2.4(DIN) L3.2(DOU)
NetL3_1: L3.1(VDD) R52.1
NetLED1_2: LED1.2(A) R23.1
NetQ2_1: Q2.1(B) U5.1
NetQ4_1: Q4.1(B) U41.1 U42.2
NetQ4_3: Q4.3(C) R22.1
NetQ5_1: Q5.1(B) R22.2
NetQ6_1: Q6.1(B) R50.1
NetQ6_2: Q6.2(E) R23.2

Not connected (* = marked no-connect by the designer): CARD1 8(DAT1) 9(CD); L2 2(DOU)

### Notes on the sheet
- 1、SIM模块直接通过杜邦线连接（串口通信）
- 1
- 2
- 3
- 4
- 5
- 6
- A
- B
- C
- 原理图
- Schematic1
- 创建日期
- 更新日期
- 2023-10-25
- 2023-11-27
- D
- 审阅
- 绘制
- 图页
- Board
- 物料编码
- New Project_2023-10-25_23-03-02
- 版本
- 尺寸
- 页
- 共
- V1.0
- A4
- 嘉立创EDA

### Library data of the parts
BUZZER2 = SFN-1407PA7.6: 驱动方式:无源(外部驱动);构造类型:压电式;额定电压:-;工作电压:-;消耗电流:-;频率:4000Hz;声压(SPL):85dB@5V,10cm;直径(φD):14mm;长度:-;宽度:-;高度:7.5mm;工作温度:-;; Manufacturer: S&amp;S(海旭); Add into BOM: yes; Technology Type: 压电式; Name: 4000Hz; Symbol: SFN-1407PA7.6; Device: SFN-1407PA7.6; LCSC Part Name: 压电无源蜂鸣器; Supplier Part: C360603; Manufacturer Part: SFN-1407PA7.6; Supplier Footprint: 插件,P=7.6mm; JLCPCB Part Class: 扩展库; Datasheet: https://atta.szlcsc.com/upload/public/pdf/source/20190422/C360603_0050A9658ADA60D80C9948846F925782.pdf; Supplier: LCSC; Convert to PCB: yes; Oscillator Circuit: 无源(外部驱动); Rated Voltage: -; Operating Voltage: -; Current Consumption: -; Value: 4000Hz; Sound Pressure Level (SPL): 85dB@5V,10cm; Diameter (φD): 14mm; Length: -; Width: -; Height: 7.5mm; Operating Temperature: -
C1 C2 C13 = 0603B104K500NT: 容值:100nF;精度:±10%;额定电压:50V;材质(温度系数):X7R;; Manufacturer: FH(风华); Add into BOM: yes; Tolerance: ±10%; Voltage Rated: 50V; Temperature Coefficient: X7R; Name: 100nF; Symbol: 0603B104K500NT; Device: 0603B104K500NT; LCSC Part Name: 100nF ±10% 50V; Supplier Part: C30926; Manufacturer Part: 0603B104K500NT; Supplier Footprint: 0603; JLCPCB Part Class: 扩展库; Datasheet: https://atta.szlcsc.com/upload/public/pdf/source/20170923/C30926_1506149436298988724.pdf; Supplier: LCSC; Convert to PCB: yes; Value: 100nF
C40 = RST47UF16V034: RST宽温通用品 105℃2000小时 等同RVT VT XT系列贴片电解电容; Manufacturer: KNSCHA(科尼盛); Add into BOM: yes; Capacitance: 47uF; Name: RST47UF16V034; Symbol: RST47UF16V034; Device: RST47UF16V034; LCSC Part Name: 贴片型铝电解电容 47uF ±20% 16V; Supplier Part: C4747957; Manufacturer Part: RST47UF16V034; Supplier Footprint: SMD,5x5.4mm; JLCPCB Part Class: 扩展库; Supplier: LCSC; Convert to PCB: yes
CARD1 = TF-01A_C2889258: 卡类型:MicroSD卡(TF卡);连接器类型:卡座;卡连接方式:自弹式;本体最大高度:2mm;工作温度范围:-;; Manufacturer: Yuandi(元迪); Add into BOM: yes; Connector Type: 卡座; Card Connection Mode: 自弹式; Maximum Body Height: 2mm; Name: TF-01A; Symbol: TF-01A_C2889258; Device: TF-01A_C2889258; LCSC Part Name: TF卡座自弹式9P外焊卡座; Supplier Part: C2889258; Manufacturer Part: TF-01A; Supplier Footprint: SMD; JLCPCB Part Class: 扩展库; Datasheet: https://atta.szlcsc.com/upload/public/pdf/source/20210830/44259D2B93BF4B637A446EF1520C4989.pdf; Supplier: LCSC; Convert to PCB: yes; Card Type: MicroSD卡(TF卡); Operating Temperature Range: -
H2 = PM254V-11-03-H85: 排数:单排;总孔位数:3P;间距:2.54mm;插孔结构:1x3P;行距:-;安装类型:直插;塑高:-;触头材质:黄铜;触头镀层:-;; Manufacturer: XFCN(兴飞); Add into BOM: yes; Number of Holes: 3P; Pitch: 2.54mm; Holes Structure: 1x3P; Name: PM254V-11-03-H85; Symbol: PM254V-11-03-H85; Device: PM254V-11-03-H85; LCSC Part Name: 间距:2.54mm 1x3P 直插; Supplier Part: C541850; Manufacturer Part: PM254V-11-03-H85; Supplier Footprint: 插件,P=2.54mm; JLCPCB Part Class: 扩展库; Datasheet: https://atta.szlcsc.com/upload/public/pdf/source/20200518/C541849_85853D71FC67C51915A806977A588FDA.pdf; Supplier: LCSC; Convert to PCB: yes; Number of Rows: 单排; Row Spacing: -; Mounting Type: 直插; Insulation Height: -; Contact Material: 黄铜; Contact Plating: -
LED1 = NCD0603G1: as LED2 on sheet 4_POW.schdoc; Name: NCD0603G1; Device: NCD0603G1; LCSC Part Name: 翠绿 0603翠绿  正贴; Supplier Part: C84267; Manufacturer Part: NCD0603G1; Supplier Footprint: 0603; JLCPCB Part Class: 扩展库; Datasheet: https://atta.szlcsc.com/upload/public/pdf/source/20200820/C84267_04BA7703640BAC111D09F5EFB971FBF3.pdf; Supplier: LCSC; Convert to PCB: yes; Dominant Wavelength: 515nm~530nm; Luminous Intensity: 330mcd~900mcd; Operating Temperature: -30℃~+85℃
Q2 Q4 Q6 = SS8050_C2150: 直流电流增益(hFE@Ic,Vce):200@100mA,1V;功率(Pd):300mW;集射极击穿电压(Vceo):25V;集电极电流(Ic):1.5A;晶体管类型:NPN;; Manufacturer: CJ(江苏长电/长晶); Add into BOM: yes; Power Dissipation (Pd): 300mW; Transition Frequency (fT): 100MHz; Collector-Emitter Breakdown Voltage (Vceo): 25V; Collector Current (Ic): 1.5A; Collector Cut-Off Current (Icbo): 100nA; Collector-Emitter Saturation Voltage (VCE(sat)@Ic,Ib): 500mV@800mA,80mA; Transistor Type: NPN; Name: SS8050; Symbol: SS8050_C2150; Device: SS8050_C2150; LCSC Part Name: 耐压:25V 电流:1.5A NPN Y1 200-350; Supplier Part: C2150; Manufacturer Part: SS8050; Supplier Footprint: SOT-23; JLCPCB Part Class: 基础库; Datasheet: https://atta.szlcsc.com/upload/public/pdf/source/20230322/AEE86F4B043774EFF80CAEA14A37D9E9.pdf; Supplier: LCSC; Convert to PCB: yes; DC Current Gain (hFE@Ic,Vce): 200@100mA,1V; Operating Temperature: +150℃@(Tj)
Q5 = SS8550: Manufacturer: Doeshare(德芯); Symbol: SS8550_C2931718; Add into BOM: yes; Name: SS8550; Device: SS8550; LCSC Part Name: PNP -25V -1.5A 120-400 SOT-23; Supplier Part: C2931718; Manufacturer Part: SS8550; Supplier Footprint: SOT-23; JLCPCB Part Class: 扩展库; Datasheet: https://atta.szlcsc.com/upload/public/pdf/source/20220104/E36293975455CDB0A899354BE4C8E85F.pdf; Supplier: LCSC; Convert to PCB: yes
R17-R19 = SCR0603J10K: as R8 on sheet 3_语音模块.schdoc; Name: 10kΩ; Symbol: SCR0603J10K; Device: SCR0603J10K; LCSC Part Name: 10kΩ ±5%; Supplier Part: C3017715; Manufacturer Part: SCR0603J10K; Supplier Footprint: 0603; JLCPCB Part Class: 扩展库; Datasheet: https://atta.szlcsc.com/upload/public/pdf/source/20220513/247AF9639BA21CF93567DC289CCC6A22.pdf; Supplier: LCSC; Convert to PCB: yes; Value: 10kΩ
R20 = SCR0603J2K2: 阻值:2.2kΩ;精度:±5%;; Manufacturer: VO(翔胜); Add into BOM: yes; Tolerance: ±5%; Name: 2.2kΩ; Symbol: SCR0603J2K2; Device: SCR0603J2K2; LCSC Part Name: 2.2kΩ ±5%; Supplier Part: C3017730; Manufacturer Part: SCR0603J2K2; Supplier Footprint: 0603; JLCPCB Part Class: 扩展库; Datasheet: https://atta.szlcsc.com/upload/public/pdf/source/20220513/247AF9639BA21CF93567DC289CCC6A22.pdf; Supplier: LCSC; Convert to PCB: yes; Value: 2.2kΩ
R21 = TC0325B3300T5F: 阻值:330Ω;精度:±0.1%;功率:100mW;温度系数:±25ppm/℃;电阻类型:薄膜电阻;; Manufacturer: UNI-ROYAL(厚声); Add into BOM: yes; Tolerance: ±0.1%; Power(Watts): 100mW; Overload Voltage (Max): 75V; Name: 330Ω; Symbol: TC0325B3300T5F; Device: TC0325B3300T5F; LCSC Part Name: 330Ω ±0.1% 100mW 薄膜电阻; Supplier Part: C2989271; Manufacturer Part: TC0325B3300T5F; Supplier Footprint: 0603; JLCPCB Part Class: 扩展库; Datasheet: https://atta.szlcsc.com/upload/public/pdf/source/20220708/6ACD1707201702E70C0F417A19EB926E.pdf; Supplier: LCSC; Convert to PCB: yes; Value: 330Ω; Temperature Coefficient: ±25ppm/℃; Type: 薄膜电阻
R22 R23 R50-R52 = SCR0603F1K: as R24 on sheet 4_POW.schdoc; Name: 1kΩ; Symbol: SCR0603F1K; Device: SCR0603F1K; LCSC Part Name: 1kΩ ±1%; Supplier Part: C3016283; Manufacturer Part: SCR0603F1K; Supplier Footprint: 0603; JLCPCB Part Class: 扩展库; Datasheet: https://atta.szlcsc.com/upload/public/pdf/source/20220513/247AF9639BA21CF93567DC289CCC6A22.pdf; Supplier: LCSC; Convert to PCB: yes; Value: 1kΩ
SW2-SW4 = K2-6639SP-C4SC-04: 触点电流:50mA;额定电压(DC):12V;绝缘电阻:100MΩ;安装方式:立贴;作用力:250gf@±30gf;机械寿命:1000000;工作温度:-25℃~+85℃;开关长度:6mm;开关宽度:6mm;开关高度:5mm;; Manufacturer: 韩国韩荣; Symbol: K2-6639SP-C4SC-04_C879344; Add into BOM: yes; Contact Current: 50mA; Voltage Rating (DC): 12V; Insulation Resistance: 100MΩ; Mounting Sytle: 立贴; Switch Length: 6mm; Switch Height: 5mm; Name: K2-6639SP-C4SC-04; Device: K2-6639SP-C4SC-04; LCSC Part Name: K2-6639SP-C4SC-04; Supplier Part: C879344; Manufacturer Part: K2-6639SP-C4SC-04; Supplier Footprint: SMD; JLCPCB Part Class: 扩展库; Datasheet: https://atta.szlcsc.com/upload/public/pdf/source/20200721/C707344_FB3B602593668C8FE1542A3F64DDEE0A.pdf; Supplier: LCSC; Convert to PCB: yes; Operating Force: 250gf@±30gf; Mechanical Life: 1000000; Operating Temperature: -25℃~+85℃; Switch Width: 6mm
U5 U41 = RTX032001BETP: 阻值:2kΩ;精度:±0.1%;; Manufacturer: RALEC(旺诠); Add into BOM: yes; Tolerance: ±0.1%; Temperature Coefficient: ±50ppm/℃; Name: 2kΩ; Symbol: RTX032001BETP; Device: RTX032001BETP; LCSC Part Name: 2kΩ ±0.1%; Supplier Part: C5141181; Manufacturer Part: RTX032001BETP; Supplier Footprint: 0603; Datasheet: https://atta.szlcsc.com/upload/public/pdf/source/20220822/046AFDAF81466BFF443BF7BC902F6DB1.pdf; Supplier: LCSC; Convert to PCB: yes; Value: 2kΩ
U11 = PM254-2-09-Z-8.5: 排数:双排;总孔位数:18P;间距:2.54mm;插孔结构:2x9P;行距:2.54mm;安装类型:直插;圆孔/方孔:方孔;额定电流:3A;额定电压:-;插孔方向:顶部;塑高:8.5mm;工作温度范围:-40℃~+105℃;; Manufacturer: HCTL(华灿天禄); Add into BOM: yes; Number of Holes: 18P; Pitch: 2.54mm; Holes Structure: 2x9P; Circular Hole / Square Hole: 方孔; Current Rating (Max): 3A; Holes Direction: 顶部; Name: PM254-2-09-Z-8.5; Symbol: PM254-2-09-Z-8.5; Device: PM254-2-09-Z-8.5; LCSC Part Name: 间距:2.54mm 2x9P 直插; Supplier Part: C2897410; Manufacturer Part: PM254-2-09-Z-8.5; Supplier Footprint: 插件,P=2.54mm; JLCPCB Part Class: 扩展库; Datasheet: https://atta.szlcsc.com/upload/public/pdf/source/20230609/3D36CA2C1BFC9FD1C3F709AD9DFEB9C2.pdf; Supplier: LCSC; Convert to PCB: yes; Number of Rows: 双排; Row Spacing: 2.54mm; Mounting Type: 直插; Voltage Rating (Max): -; Insulation Height: 8.5mm; Operating Temperature Range: -40℃~+105℃
U42 = C1608X8R2A103K080AA: as U16 on sheet 3_语音模块.schdoc; Name: 10nF; Symbol: C1608X8R2A103K080AA; Device: C1608X8R2A103K080AA; LCSC Part Name: 10nF ±10% 100V; Supplier Part: C3865495; Manufacturer Part: C1608X8R2A103K080AA; Supplier Footprint: 0603; Supplier: LCSC; Convert to PCB: yes; Value: 10nF

## Sheet 2_MCU.schdoc.schdoc
size 431 x 309 mm; Symbol: Sheet-Symbol_A4; Device: Sheet-Symbol_A4; @Page Name: MCU; @Create Date: 2023-11-05; @Page Count: 4; @Page No: 4; @Project Name: New Project_2023-10-25_23-03-02; @Schematic Name: Schematic1; @Update Date: 2023-12-01; Company: 嘉立创EDA; Page Size: A4; Version: V1.0; SheetNumber: 4; SheetTotal: 4
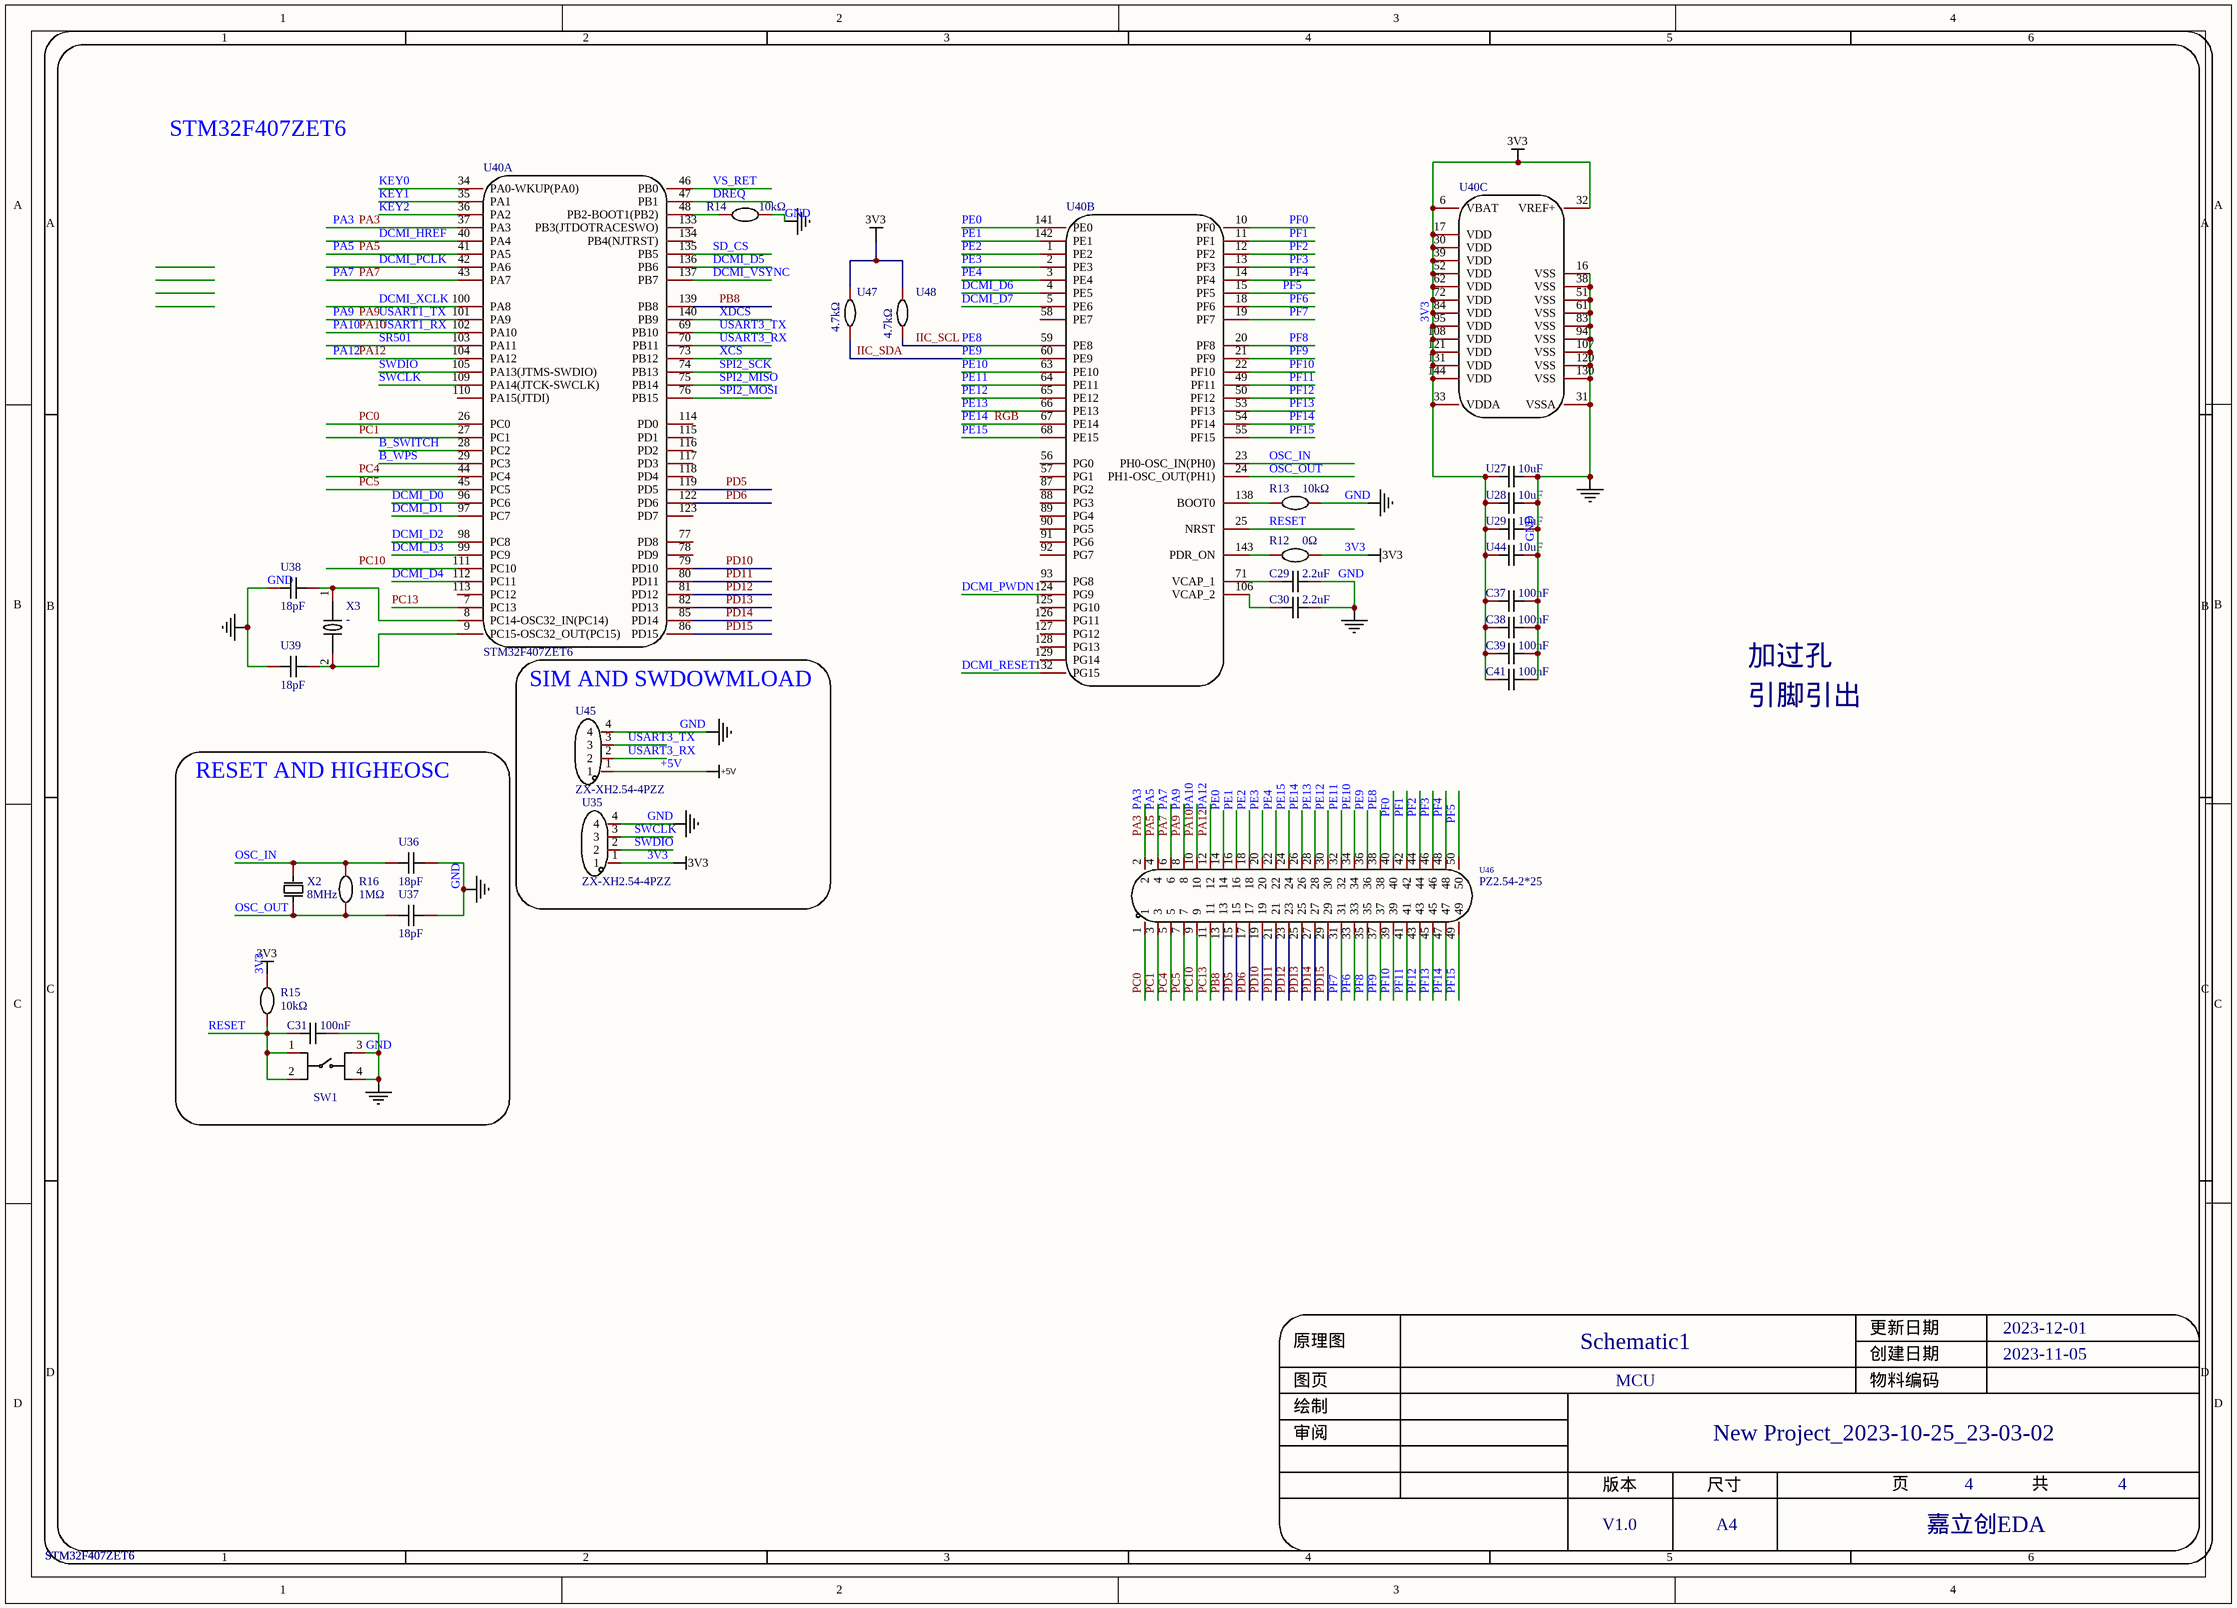
[diagram p3: 2_MCU.schdoc.schdoc]

### Parts
C29  2.2uF  [C0603]
C30  2.2uF  [C0603]
C31  100nF  [C0603]
C37  100nF  [C0603]
C38  100nF  [C0603]
C39  100nF  [C0603]
C41  100nF  [C0603]
R12  0Ω  [R0603]
R13  10kΩ  [R0603]
R14  10kΩ  [R0603]
R15  10kΩ  [R0603]
R16  1MΩ  [R0603]
SW1  K2-6639SP-C4SC-04  [KEY-SMD_4P-L6.0-W6.0-P3.90-LS10.0]  (value not drawn)
U27  10uF  [C0603]
U28  10uF  [C0603]
U29  10uF  [C0603]
U35  ZX-XH2.54-4PZZ  [CONN-TH_4P-P2.50_4PIN]
U36  18pF  [C0603]
U37  18pF  [C0603]
U38  18pF  [C0603]
U39  18pF  [C0603]
U40  STM32F407ZET6  [LQFP-144_L20.0-W20.0-P0.50-LS22.0-BL]  (parts A,B,C of 3)
U44  10uF  [C0603]
U45  ZX-XH2.54-4PZZ  [CONN-TH_4P-P2.50_4PIN]
U46  PZ2.54-2*25  [HDR-TH_50P-P2.54-V-M-R2-C25-S2.54]
U47  4.7kΩ  [R0603]
U48  4.7kΩ  [R0603]
X2  8MHz  [OSC-SMD_L5.0-W3.2]
X3  -  [OSC-SMD_2P-L1.6-W1.0]

### Blocks framed on the sheet
SIM AND SWDOWMLOAD: U35 U45
RESET AND HIGHEOSC: C31 R15 R16 SW1 U36 U37 X2

### Nets
3V3: C37.1 C38.1 C39.1 C41.1 R12.2 R15.2 U27.1 U28.1 U29.1 U35.1 U40.6(VBAT) U40.17(VDD) U40.30(VDD) U40.32(VREF+) U40.33(VDDA) U40.39(VDD) U40.52(VDD) U40.62(VDD) U40.72(VDD) U40.84(VDD) U40.95(VDD) U40.108(VDD) U40.121(VDD) U40.131(VDD) U40.144(VDD) U44.1 U47.1 U48.1
+5V: U45.1
GND: C29.2 C30.2 C31.2 C37.2 C38.2 C39.2 C41.2 R13.2 R14.2 SW1.3 SW1.4 U27.2 U28.2 U29.2 U35.4 U36.2 U37.2 U38.1 U39.1 U40.16(VSS) U40.31(VSSA) U40.38(VSS) U40.51(VSS) U40.61(VSS) U40.83(VSS) U40.94(VSS) U40.107(VSS) U40.120(VSS) U40.130(VSS) U44.2 U45.4
B_SWITCH: U40.28(PC2)
B_WPS: U40.29(PC3)
DCMI_D0: U40.96(PC6)
DCMI_D1: U40.97(PC7)
DCMI_D2: U40.98(PC8)
DCMI_D3: U40.99(PC9)
DCMI_D4: U40.112(PC11)
DCMI_D5: U40.136(PB6)
DCMI_D6: U40.4(PE5)
DCMI_D7: U40.5(PE6)
DCMI_HREF: U40.40(PA4)
DCMI_PCLK: U40.42(PA6)
DCMI_PWDN: U40.124(PG9)
DCMI_RESET: U40.132(PG15)
DCMI_VSYNC: U40.137(PB7)
DCMI_XCLK: U40.100(PA8)
DREQ: U40.47(PB1)
IIC_SCL: U40.59(PE8) U46.38 U48.2  [also labelled PE8]
IIC_SDA: U40.60(PE9) U46.36 U47.2  [also labelled PE9]
KEY0: U40.34(PA0-WKUP(PA0))
KEY1: U40.35(PA1)
KEY2: U40.36(PA2)
OSC_IN: R16.2 U36.1 U40.23(PH0-OSC_IN(PH0)) X2.2(OSC2)
OSC_OUT: R16.1 U37.1 U40.24(PH1-OSC_OUT(PH1)) X2.1(OSC1)
PA3: U40.37(PA3) U46.2
PA5: U40.41(PA5) U46.4
PA7: U40.43(PA7) U46.6
PA9: U40.101(PA9) U46.8  [also labelled USART1_TX]
PA10: U40.102(PA10) U46.10  [also labelled USART1_RX]
PA12: U40.104(PA12) U46.12
PB8: U40.139(PB8) U46.13
PC0: U40.26(PC0) U46.1
PC1: U40.27(PC1) U46.3
PC4: U40.44(PC4) U46.5
PC5: U40.45(PC5) U46.7
PC10: U40.111(PC10) U46.9
PC13: U40.7(PC13) U46.11
PD5: U40.119(PD5) U46.15
PD6: U40.122(PD6) U46.17
PD10: U40.79(PD10) U46.19
PD11: U40.80(PD11) U46.21
PD12: U40.81(PD12) U46.23
PD13: U40.82(PD13) U46.25
PD14: U40.85(PD14) U46.27
PD15: U40.86(PD15) U46.29
PE0: U40.141(PE0) U46.14
PE1: U40.142(PE1) U46.16
PE2: U40.1(PE2) U46.18
PE3: U40.2(PE3) U46.20
PE4: U40.3(PE4) U46.22
PE10: U40.63(PE10) U46.34
PE11: U40.64(PE11) U46.32
PE12: U40.65(PE12) U46.30
PE13: U40.66(PE13) U46.28
PE14: U40.67(PE14) U46.26  [also labelled RGB]
PE15: U40.68(PE15) U46.24
PF0: U40.10(PF0) U46.40
PF1: U40.11(PF1) U46.42
PF2: U40.12(PF2) U46.44
PF3: U40.13(PF3) U46.46
PF4: U40.14(PF4) U46.48
PF5: U40.15(PF5) U46.50
PF6: U40.18(PF6) U46.33
PF7: U40.19(PF7) U46.31
PF8: U40.20(PF8) U46.35
PF9: U40.21(PF9) U46.37
PF10: U40.22(PF10) U46.39
PF11: U40.49(PF11) U46.41
PF12: U40.50(PF12) U46.43
PF13: U40.53(PF13) U46.45
PF14: U40.54(PF14) U46.47
PF15: U40.55(PF15) U46.49
RESET: C31.1 R15.1 SW1.1 SW1.2 U40.25(NRST)
SD_CS: U40.135(PB5)
SPI2_MISO: U40.75(PB14)
SPI2_MOSI: U40.76(PB15)
SPI2_SCK: U40.74(PB13)
SR501: U40.103(PA11)
SWCLK: U35.3 U40.109(PA14(JTCK-SWCLK))
SWDIO: U35.2 U40.105(PA13(JTMS-SWDIO))
USART3_RX: U40.70(PB11) U45.2
USART3_TX: U40.69(PB10) U45.3
VS_RET: U40.46(PB0)
XCS: U40.73(PB12)
XDCS: U40.140(PB9)
NetC29_1: C29.1 U40.71(VCAP_1)
NetC30_1: C30.1 U40.106(VCAP_2)
NetR12_1: R12.1 U40.143(PDR_ON)
NetR13_1: R13.1 U40.138(BOOT0)
NetR14_1: R14.1 U40.48(PB2-BOOT1(PB2))
NetU38_2: U38.2 U40.8(PC14-OSC32_IN(PC14)) X3.1
NetU39_2: U39.2 U40.9(PC15-OSC32_OUT(PC15)) X3.2

Not connected (* = marked no-connect by the designer): U40 56(PG0) 57(PG1) 58(PE7) 77(PD8) 78(PD9) 87(PG2) 88(PG3) 89(PG4) 90(PG5) 91(PG6) 92(PG7) 93(PG8) 110(PA15(JTDI)) 113(PC12) 114(PD0) 115(PD1) 116(PD2) 117(PD3) 118(PD4) 123(PD7) 125(PG10) 126(PG11) 127(PG12) 128(PG13) 129(PG14) 133(PB3(JTDOTRACESWO)) 134(PB4(NJTRST))

### Notes on the sheet
- STM32F407ZET6
- 加过孔
- 引脚引出
- 1
- 2
- 3
- 4
- 5
- 6
- A
- B
- C
- D
- 原理图
- Schematic1
- 创建日期
- 更新日期
- 2023-11-05
- 2023-12-01
- 审阅
- 绘制
- 图页
- MCU
- 物料编码
- New Project_2023-10-25_23-03-02
- 版本
- 尺寸
- 页
- 共
- V1.0
- A4
- 嘉立创EDA

### Library data of the parts
C29 C30 = C1608X6S1A225K080AB: 容值:2.2uF;精度:±10%;额定电压:10V;材质(温度系数):X6S;; Manufacturer: TDK; Add into BOM: yes; Tolerance: ±10%; Voltage Rated: 10V; Temperature Coefficient: X6S; Name: 2.2uF; Symbol: C1608X6S1A225K080AB; Device: C1608X6S1A225K080AB; LCSC Part Name: 2.2uF ±10% 10V; Supplier Part: C3888161; Manufacturer Part: C1608X6S1A225K080AB; Supplier Footprint: 0603; Supplier: LCSC; Convert to PCB: yes; Value: 2.2uF
C31 C37-C39 C41 = CGA3E3X8R1H104M080AE: as C11 on sheet 4_POW.schdoc; Name: 100nF; Symbol: CGA3E3X8R1H104M080AE; Device: CGA3E3X8R1H104M080AE; LCSC Part Name: 100nF ±20% 50V; Supplier Part: C3855738; Manufacturer Part: CGA3E3X8R1H104M080AE; Supplier Footprint: 0603; Supplier: LCSC; Convert to PCB: yes; Value: 100nF
R12 = RC0603JR-130RL: 电阻类型:厚膜电阻;阻值:0Ω;精度:-;功率:100mW;; Manufacturer: YAGEO(国巨); Add into BOM: yes; Power(Watts): 100mW; Overload Voltage (Max): 75V; Name: 0Ω; Symbol: RC0603JR-130RL; Device: RC0603JR-130RL; LCSC Part Name: 0Ω 100mW; Supplier Part: C1512169; Manufacturer Part: RC0603JR-130RL; Supplier Footprint: 0603; JLCPCB Part Class: 扩展库; Datasheet: https://atta.szlcsc.com/upload/public/pdf/source/20210615/C1512169_F749B83676031E9170C7C93785487C19.pdf; Supplier: LCSC; Convert to PCB: yes; Type: 厚膜电阻; Value: 0Ω; Tolerance: -; Temperature Coefficient: -; Operating Temperature Range: -55℃~+155℃
R13-R15 = SCR0603J10K: as R8 on sheet 3_语音模块.schdoc; Name: 10kΩ; Symbol: SCR0603J10K; Device: SCR0603J10K; LCSC Part Name: 10kΩ ±5%; Supplier Part: C3017715; Manufacturer Part: SCR0603J10K; Supplier Footprint: 0603; JLCPCB Part Class: 扩展库; Datasheet: https://atta.szlcsc.com/upload/public/pdf/source/20220513/247AF9639BA21CF93567DC289CCC6A22.pdf; Supplier: LCSC; Convert to PCB: yes; Value: 10kΩ
R16 = CRCW06031M00JNEAC: 电阻类型:厚膜电阻;阻值:1MΩ;精度:±5%;功率:100mW;; Manufacturer: VISHAY(威世); Add into BOM: yes; Tolerance: ±5%; Power(Watts): 100mW; Temperature Coefficient: ±200ppm/℃; Overload Voltage (Max): 75V; Name: 1MΩ; Symbol: CRCW06031M00JNEAC; Device: CRCW06031M00JNEAC; LCSC Part Name: 1MΩ ±5% 100mW; Supplier Part: C1511824; Manufacturer Part: CRCW06031M00JNEAC; Supplier Footprint: 0603; JLCPCB Part Class: 扩展库; Datasheet: https://atta.szlcsc.com/upload/public/pdf/source/20210501/3A8C68602BA6317D7357138250FC3EA2.pdf; Supplier: LCSC; Convert to PCB: yes; Type: 厚膜电阻; Value: 1MΩ; Operating Temperature Range: -55℃~+155℃
SW1 = K2-6639SP-C4SC-04: as SW2 on sheet 1_Board.schdoc; Name: K2-6639SP-C4SC-04; Device: K2-6639SP-C4SC-04; LCSC Part Name: K2-6639SP-C4SC-04; Supplier Part: C879344; Manufacturer Part: K2-6639SP-C4SC-04; Supplier Footprint: SMD; JLCPCB Part Class: 扩展库; Datasheet: https://atta.szlcsc.com/upload/public/pdf/source/20200721/C707344_FB3B602593668C8FE1542A3F64DDEE0A.pdf; Supplier: LCSC; Convert to PCB: yes; Operating Force: 250gf@±30gf; Mechanical Life: 1000000; Operating Temperature: -25℃~+85℃; Switch Width: 6mm
U27-U29 U44 = C1608JB1C106M080AB: 容值:10uF;精度:±20%;额定电压:16V;材质(温度系数):JB;; Manufacturer: TDK; Add into BOM: yes; Tolerance: ±20%; Voltage Rated: 16V; Temperature Coefficient: JB; Name: 10uF; Symbol: C1608JB1C106M080AB; Device: C1608JB1C106M080AB; LCSC Part Name: 10uF ±20% 16V; Supplier Part: C3866185; Manufacturer Part: C1608JB1C106M080AB; Supplier Footprint: 0603; Supplier: LCSC; Convert to PCB: yes; Value: 10uF
U35 U45 = ZX-XH2.54-4PZZ: 参考系列:XH;间距:2.54mm;插针结构:1x4P;排数:1;每排PIN数:4;行距:-;公母:公型插针;安装方式:直插;额定电流:3A;触头材质:黄铜;触头镀层:锡;工作温度范围:-25℃~+85℃;焊接温度(最大值):260℃;; Manufacturer: Megastar(兆星); Add into BOM: yes; Reference Series: XH; Pitch: 2.54mm; Pins Structure: 1x4P; Number of PINs Per Row: 4; Gender: 公型插针; Current Rating (Max): 3A; Welding Temperature (Max): 260℃; Name: ZX-XH2.54-4PZZ; Symbol: ZX-XH2.54-4PZZ; Device: ZX-XH2.54-4PZZ; LCSC Part Name: 系列:XH 间距:2.54mm 1x4P 直插; Supplier Part: C7429634; Manufacturer Part: ZX-XH2.54-4PZZ; Supplier Footprint: 插件,P=2.54mm; JLCPCB Part Class: 扩展库; Datasheet: https://atta.szlcsc.com/upload/public/pdf/source/20230619/B529A2163E0159A644AB3383D208FB03.pdf; Supplier: LCSC; Convert to PCB: yes; Number of Rows: 1; Row Spacing: -; Mounting Style: 直插; Contact Material: 黄铜; Contact Plating: 锡; Operating Temperature Range: -25℃~+85℃
U36-U39 = C1608CH2A180J080AA: as U7 on sheet 3_语音模块.schdoc; Name: 18pF; Symbol: C1608CH2A180J080AA; Device: C1608CH2A180J080AA; LCSC Part Name: 18pF ±5% 100V; Supplier Part: C3847790; Manufacturer Part: C1608CH2A180J080AA; Supplier Footprint: -; JLCPCB Part Class: 扩展库; Supplier: LCSC; Convert to PCB: yes; Value: 18pF
U40 = STM32F407ZET6: CPU内核:ARM Cortex-M4;CPU最大主频:168MHz;工作电压范围:1.8V~3.6V;程序存储容量:512KB;程序存储器类型:FLASH;RAM总容量:192KB;GPIO端口数量:114;; Manufacturer: ST(意法半导体); Add into BOM: yes; CPU Maximum Speed: 168MHz; Program Storage Size: 512KB; Program Memory Type: FLASH; RAM Size: 192KB; GPIO Ports Number: 114; ADC (Bit): 12bit; Universal Serial Bus: 有; tags: STM32; Name: STM32F407ZET6; Symbol: STM32F407ZET6; Device: STM32F407ZET6; LCSC Part Name: STM32F407ZET6; Supplier Part: C36869; Manufacturer Part: STM32F407ZET6; Supplier Footprint: LQFP-144(20x20); JLCPCB Part Class: 扩展库; Datasheet: https://atta.szlcsc.com/upload/public/pdf/source/20160816/1471342957598.pdf; Supplier: LCSC; Convert to PCB: yes; CPU Core: ARM Cortex-M4; Operating Voltage Range: 1.8V~3.6V; EEPROM: -; DAC (Bit): 12bit; PWM (Bit): -; Internal Comparator: -; communication protocol: -; Watchdog: 有; Real-Time Clock: -; Infrared Data Association: 有; Low-Voltage Detect: 有; CCP Capture/Compare: -; LCD Module: 有; Secure Digital Input and Output: -; Direct Memory Access: 有; Internal Oscillator: 有; Operating Temperature Range: -40℃~+85℃; image: http://image.lceda.cn/szlcsc/C36869.jpg
U46 = PZ2.54-2*25: Manufacturer: ZHOURI(洲日); Add into BOM: yes; Name: PZ2.54-2*25; Symbol: PZ2.54-2*25; Device: PZ2.54-2*25; LCSC Part Name: 排针 2*25 2.54 11.6MM 镀金; Supplier Part: C5360897; Manufacturer Part: PZ2.54-2*25; Supplier Footprint: DIP; JLCPCB Part Class: 扩展库; Supplier: LCSC; Convert to PCB: yes
U47 U48 = AR03FTDX4701A: 电阻类型:薄膜电阻;阻值:4.7kΩ;精度:±1%;功率:100mW;; Manufacturer: Viking(光颉); Add into BOM: yes; Tolerance: ±1%; Power(Watts): 100mW; Temperature Coefficient: ±50ppm/℃; Overload Voltage (Max): 75V; Name: 4.7kΩ; Symbol: AR03FTDX4701A; Device: AR03FTDX4701A; LCSC Part Name: 4.7kΩ ±1% 100mW; Supplier Part: C2924150; Manufacturer Part: AR03FTDX4701A; Supplier Footprint: 0603; JLCPCB Part Class: 扩展库; Datasheet: https://atta.szlcsc.com/upload/public/pdf/source/20211123/7AFDB03DAF68AA91648A852AAE26A3AB.pdf; Supplier: LCSC; Convert to PCB: yes; Type: 薄膜电阻; Value: 4.7kΩ; Operating Temperature Range: -55℃~+155℃
X2 = TAXM8M2QLFCDT1T: 频率:8MHz;频率公差:±30ppm;负载电容:20pF;; Manufacturer: TAE(雅晶鑫); Symbol: SMD-5032_2P 8M 20pf 30ppm; Add into BOM: yes; Crystal Type: 贴片无源晶振; Frequency Tolerance: ±30ppm; Frequency Stability: ±20ppm; Load Capacitance: 20pF; Equivalent Series Resistance (ESR): 80Ω; Name: 8MHz; Device: TAXM8M2QLFCDT1T; LCSC Part Name: 8MHz ±30ppm 20pF; Supplier Part: C122522; Manufacturer Part: TAXM8M2QLFCDT1T; Supplier Footprint: SMD5032-2P; JLCPCB Part Class: 扩展库; Datasheet: https://atta.szlcsc.com/upload/public/pdf/source/20220113/59EE8A0E7B9F67FF1BF3C454890DE4E5.pdf; Supplier: LCSC; Convert to PCB: yes; Value: 8MHz; Operating Temperature: -40℃~+85℃
X3 = TFX-04-32.768K: 频率:-;负载电容:-;; Manufacturer: RIVER(大河); Symbol: TFX-04-32.768K_C515348; Add into BOM: yes; Name: -; Device: TFX-04-32.768K; LCSC Part Name: 时钟晶体 32.768kHz 4PF 20PPM; Supplier Part: C515348; Manufacturer Part: TFX-04-32.768K; Supplier Footprint: SMD1610-2P; JLCPCB Part Class: 扩展库; Datasheet: https://atta.szlcsc.com/upload/public/pdf/source/20200917/C515346_EDFB4A3F7406CD145B2E2A90CB656616.pdf; Supplier: LCSC; Convert to PCB: yes; Crystal Type: -; Value: -; Load Capacitance: -; Operating Temperature: -